# EAGLE design untitled (EAGLE 9.6.2)
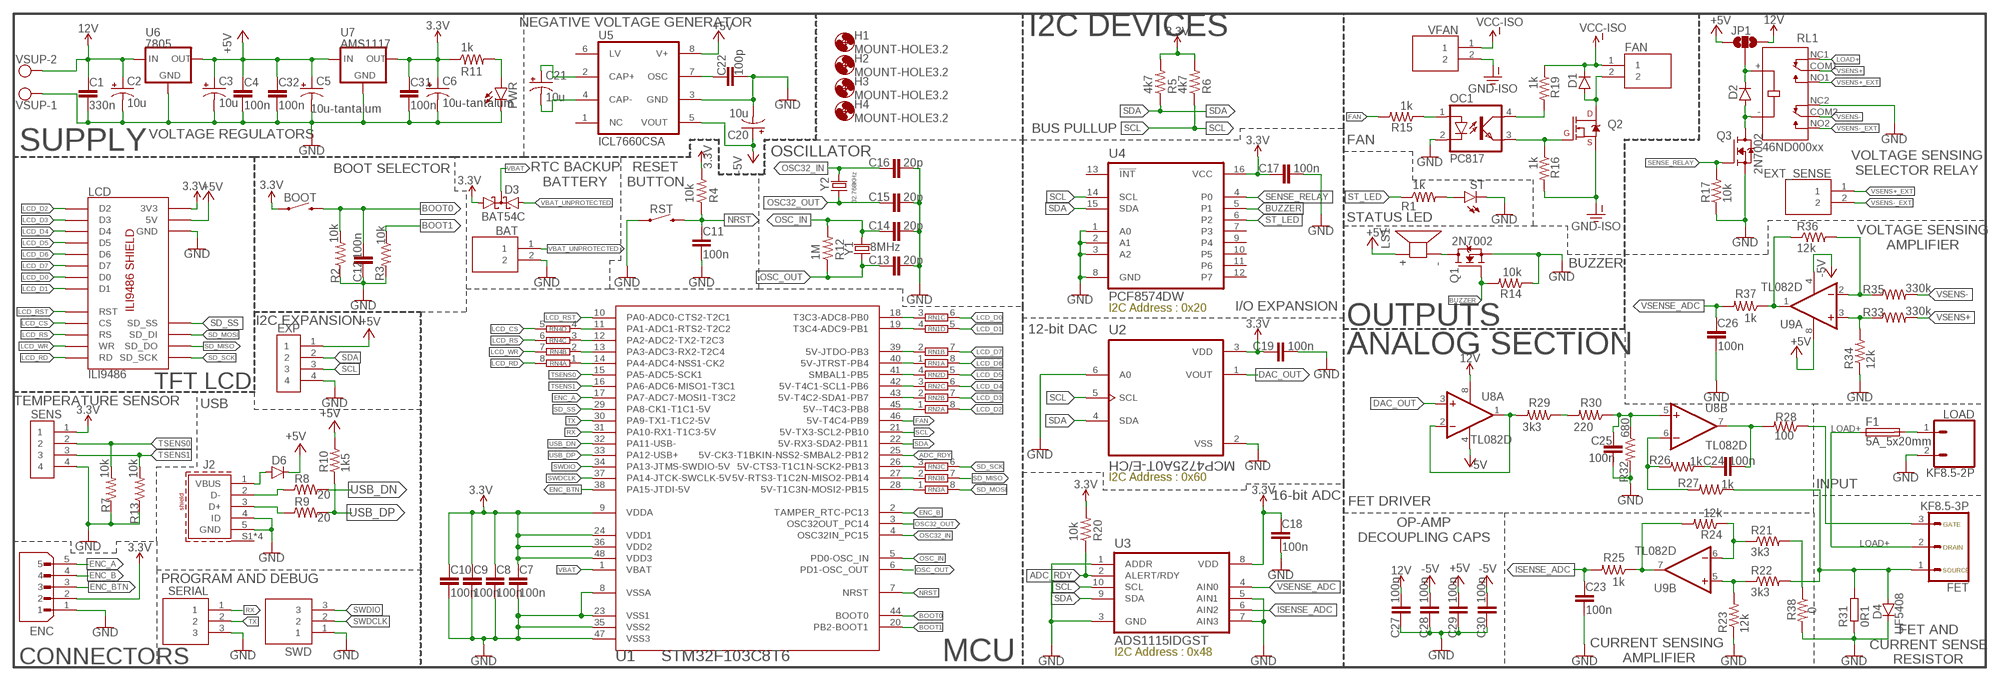
[diagram p0: schematic, sheet 1]

## Parts
BAT  B2B-XH-A(LF)(SN)  [JST_B2B-XH-A(LF)(SN)]
BOOT  MOMENTARY-SWITCH-SPST-SMD-6.0X3.5MM  [TACTILE_SWITCH_SMD_6.0X3.5MM]
C1  330n  C-EUC0805  [C0805]
C2  10u  CPOL-USE2.5-6  [E2,5-6]
C3  10u  CPOL-USE2.5-6  [E2,5-6]
C4  100n  C-EUC0805  [C0805]
C5  10u-tantalum  CPOL-USCT3528  [CT3528]
C6  10u-tantalum  CPOL-USCT3528  [CT3528]
C7  100n  C-EUC0805  [C0805]
C8  100n  C-EUC0805  [C0805]
C9  100n  C-EUC0805  [C0805]
C10  100n  C-EUC0805  [C0805]
C11  100n  C-EUC0805  [C0805]
C12  100n  C-EUC0805  [C0805]
C13  20p  C-EUC0805  [C0805]
C14  20p  C-EUC0805  [C0805]
C15  20p  C-EUC0805  [C0805]
C16  20p  C-EUC0805  [C0805]
C17  100n  C-EUC0805  [C0805]
C18  100n  C-EUC0805  [C0805]
C19  100n  C-EUC0805  [C0805]
C20  10u  CPOL-USE2.5-6  [E2,5-6]
C21  10u  CPOL-USE2.5-6  [E2,5-6]
C22  100p  C-EUC0805  [C0805]
C23  100n  C-EUC0805  [C0805]
C24  100n  C-EUC0805  [C0805]
C25  100n  C-EUC0805  [C0805]
C26  100n  C-EUC0805  [C0805]
C27  100n  C-EUC0805  [C0805]
C28  100n  C-EUC0805  [C0805]
C29  100n  C-EUC0805  [C0805]
C30  100n  C-EUC0805  [C0805]
C31  100n  C-EUC0805  [C0805]
C32  100n  C-EUC0805  [C0805]
D1  DIODE-DO-214AC  [DO-214AC]
D2  DIODE-DO-214AC  [DO-214AC]
D3  BAT54C  [SOT23]
D4  UF5408  DIODE-DO201-15  [DO201-15]
D6  DIODE-DO-214AC  [DO-214AC]
ENC  B5B-XH-A(LF)(SN)  [JST_B5B-XH-A(LF)(SN)]
EXP  JST-XH-4P  B4B-XH-A(LF)(SN)  [JST_B4B-XH-A(LF)(SN)]
EXT_SENSE  B2B-XH-A(LF)(SN)  [JST_B2B-XH-A(LF)(SN)]
F1  5A_5x20mm  FUSEBLANK_5X20MM  [FUSE_HOLDER_5X20MM]
FAN  B2B-XH-A(LF)(SN)  [JST_B2B-XH-A(LF)(SN)]
FET  KF8.5-3P  KF7.62-3P  [KF7.62-3P]
H1  MOUNT-HOLE3.2  [3,2]
H2  MOUNT-HOLE3.2  [3,2]
H3  MOUNT-HOLE3.2  [3,2]
H4  MOUNT-HOLE3.2  [3,2]
J2  629105136821  [629105136821]
JP1  JUMPER-SMT_3_NO_SILK  [SMT-JUMPER_3_NO_SILK]
LCD  ILI9486  [ILI9486-SHIELD]
LOAD  KF8.5-2P  KF7.62-2P  [KF7.62]
LS1  AI-1223-TWT-12V-R  [XDCR_AI-1223-TWT-12V-R]
OC1  PC817  [DIL04]
PWR  LEDCHIP-LED0805  [CHIP-LED0805]
Q1  2N7002  [SOT95P240X111-3N]
Q2  MOSFET-NCH-FDD8780  [TO-252/DPAK]
Q3  2N7002  [SOT95P240X111-3N]
R1  1k  R-US_M0805  [M0805]
R2  10k  R-US_M0805  [M0805]
R3  10k  R-US_M0805  [M0805]
R4  10k  R-US_M0805  [M0805]
R5  4k7  R-US_M0805  [M0805]
R6  4k7  R-US_M0805  [M0805]
R7  10k  R-US_M0805  [M0805]
R8  20  R-US_M0805  [M0805]
R9  20  R-US_M0805  [M0805]
R10  1k5  R-US_M0805  [M0805]
R11  1k  R-US_M0805  [M0805]
R12  1M  R-US_M0805  [M0805]
R13  10k  R-US_M0805  [M0805]
R14  10k  R-US_M0805  [M0805]
R15  1k  R-US_M0805  [M0805]
R16  1k  R-US_M0805  [M0805]
R17  10k  R-US_M0805  [M0805]
R19  1k  R-US_M0805  [M0805]
R20  10k  R-US_M0805  [M0805]
R21  3k3  R-US_R0603  [R0603]
R22  3k3  R-US_R0603  [R0603]
R23  12k  R-US_R0603  [R0603]
R24  12k  R-US_R0603  [R0603]
R25  1k  R-US_R0603  [R0603]
R26  1k  R-US_M0805  [M0805]
R27  1k  R-US_M0805  [M0805]
R28  100  R-US_M0805  [M0805]
R29  3k3  R-US_M0805  [M0805]
R30  220  R-US_M0805  [M0805]
R31  0R1  R-EU_0922/22  [0922/22]
R32  680  R-US_M0805  [M0805]
R33  330k  R-US_R0603  [R0603]
R34  12k  R-US_R0603  [R0603]
R35  330k  R-US_R0603  [R0603]
R36  12k  R-US_R0603  [R0603]
R37  1k  R-US_R0603  [R0603]
R38  0  R-US_M0805  [M0805]
RL1  46ND000xx  G2RL-2_12DC  [RELAY_G2RL-2_12DC]
RN1  4R-N0402ARV341  [4X0402ARV341]
RN2  4R-N0402ARV341  [4X0402ARV341]
RN3  4R-N0402ARV341  [4X0402ARV341]
RN4  4R-N0402ARV341  [4X0402ARV341]
RST  MOMENTARY-SWITCH-SPST-SMD-6.0X3.5MM  [TACTILE_SWITCH_SMD_6.0X3.5MM]
SENS  JST-XH-4P  B4B-XH-A(LF)(SN)  [JST_B4B-XH-A(LF)(SN)]
SERIAL  B3B-XH-A(LF)(SN)  [JST_B3B-XH-A(LF)(SN)]
ST  LEDCHIP-LED0805  [CHIP-LED0805]
SWD  B3B-XH-A(LF)(SN)  [JST_B3B-XH-A(LF)(SN)]
U1  STM32F103C8T6  [TQFP48]
U2  MCP4725A0T-E/CH  [SOT95P270X145-6N]
U3  ADS1115IDGST  [SOP50P490X110-10N]
U4  PCF8574DW  [SOIC127P1030X265-16N]
U5  ICL7660CSA  [SO08]
U6  7805  78XXS  [78XXS]
U7  AMS1117  [SOT89R]
U8  TL082D  [SO08]
U9  TL082D  [SO08]
VFAN  B2B-XH-A(LF)(SN)  [JST_B2B-XH-A(LF)(SN)]
VSUP  MKDSN1,5/2-5,08  [MKDSN1,5/2-5,08]
Y1  8MHz  CRYSTALPTH-HC49US  [HC49US]
Y2  32.768KHz  MC-306  [MC-306]

## Nets
3.3V: BOOT.1 C6.+ C7.1 C8.1 C9.1 C10.1 C17.1 C18.1 C19.1 C31.1 D3.1(A1) ENC.2 LCD.3V3 R4.2 R5.2 R6.2 R11.1 R20.2 SENS.1 U1.9(VDDA) U1.24(VDD1) U1.36(VDD2) U1.48(VDD3) U2.3(VDD) U3.8(VDD) U4.16(VCC) U7.3(OUT) U7.4(OUT)
12V: C1.1 C2.+ C27.2 JP1.3 U6.IN U8.8(P:V+) VSUP.2
+5V: C3.+ C4.1 C5.+ C29.2 C32.1 D6.C EXP.1 JP1.1 LCD.5V LS1.P(+) R10.2 U5.8(V+) U6.OUT U7.1(IN) U9.8(P:V+)
-5V: C20.+ C28.2 C30.2 U5.5(VOUT) U8.4(P:V-) U9.4(P:V-)
ADC_RDY: R20.1 U1.25(5V-CK3-T1BKIN-NSS2-SMBAL2-PB12) U3.2(ALERT/RDY)
BOOT0: BOOT.2 C12.1 R2.2 U1.44(BOOT0)
BOOT1: R3.1 U1.20(PB2-BOOT1)
BUZZER: Q1.1(G) R14.2 U4.5(P1)
DAC_OUT: U2.1(VOUT) U8.3(A:+IN)
ENC_A: ENC.5 U1.17(PA7-ADC7-MOSI1-T3C2)
ENC_B: ENC.4 U1.2(TAMPER_RTC-PC13)
ENC_BTN: ENC.3 U1.38(PA15-JTDI-5V)
FAN: R15.2 U1.46(5V-T4C4-PB9)
GND: BAT.2 C1.2 C2.- C3.- C4.2 C5.- C6.- C7.2 C8.2 C9.2 C10.2 C11.2 C12.2 C13.2 C14.2 C15.2 C16.2 C17.2 C18.2 C19.2 C20.- C22.1 C23.2 C25.1 C26.2 C27.1 C28.1 C29.1 C30.1 C31.2 C32.2 D4.C ENC.1 EXP.4 J2.4(ID) J2.5(GND) LCD.GND LCD.GND1(GND) LCD.GND2(GND) LOAD.2 OC1.2(C) PWR.C Q1.2(S) Q3.2(S) R2.1 R3.2 R7.1 R13.1 R14.1 R17.1 R23.1 R31.1 R32.2 R34.1 R38.2 RL1.NC2 RST.1 SENS.4 SERIAL.3 ST.C SWD.1 U1.8(VSSA) U1.23(VSS1) U1.35(VSS2) U1.47(VSS3) U2.2(VSS) U2.6(A0) U3.1(ADDR) U3.3(GND) U3.5(AIN1) U3.7(AIN3) U4.1(A0) U4.2(A1) U4.3(A2) U4.8(GND) U5.3(GND) U6.GND U7.2(GND) VSUP.1
GND-ISO: Q2.3(S) R16.2 VFAN.2
ISENSE_ADC: C23.1 R25.2 U3.6(AIN2)
LCD_CS: LCD.LCD_CS(CS) RN4.5
LCD_D0: LCD.LCD_D0(D0) RN1.6
LCD_D1: LCD.LCD_D1(D1) RN1.5
LCD_D2: LCD.LCD_D2(D2) RN2.8
LCD_D3: LCD.LCD_D3(D3) RN2.7
LCD_D4: LCD.LCD_D4(D4) RN2.6
LCD_D5: LCD.LCD_D5(D5) RN2.5
LCD_D6: LCD.LCD_D6(D6) RN1.8
LCD_D7: LCD.LCD_D7(D7) RN1.7
LCD_RD: LCD.LCD_RD(RD) RN4.8
LCD_RS: LCD.LCD_RS(RS) RN4.6
LCD_RST: LCD.LCD_RST(RST) U1.10(PA0-ADC0-CTS2-T2C1)
LCD_WR: LCD.LCD_WR(WR) RN4.7
LOAD+: F1.1 FET.2 RL1.NC1
N$1: LS1.N(-) Q1.3(D)
N$2: RN1.3 U1.18(T3C3-ADC8-PB0)
N$3: RN1.4 U1.19(T3C4-ADC9-PB1)
N$4: PWR.A R11.2
N$5: RN1.2 U1.39(5V-JTDO-PB3)
N$6: D6.A J2.1(VBUS)
N$7: RN1.1 U1.40(5V-JTRST-PB4)
N$8: RN2.4 U1.41(SMBAL1-PB5)
N$9: RN2.3 U1.42(5V-T4C1-SCL1-PB6)
N$10: RN2.1 U1.45(5V--T4C3-PB8)
N$11: RN2.2 U1.43(5V-T4C2-SDA1-PB7)
N$12: RN3.3 U1.26(5V-CTS3-T1C1N-SCK2-PB13)
N$13: RN3.2 U1.27(5V-RTS3-T1C2N-MISO2-PB14)
N$14: RN3.1 U1.28(5V-T1C3N-MOSI2-PB15)
N$15: RN4.4 U1.11(PA1-ADC1-RTS2-T2C2)
N$16: J2.3(D+) R9.1
N$17: RN4.3 U1.12(PA2-ADC2-TX2-T2C3)
N$18: J2.2(D-) R8.1
N$19: RN4.1 U1.14(PA4-ADC4-NSS1-CK2)
N$20: RN4.2 U1.13(PA3-ADC3-RX2-T2C4)
N$21: OC1.3(EMIT) Q2.1(G) R16.1
N$22: R1.2 ST.A
N$23: OC1.1(A) R15.1
N$24: D1.A FAN.2 Q2.2(D)
N$25: D2.A Q3.3(D) RL1.-(COIL2)
N$26: OC1.4(COL) R19.2
N$27: D2.C JP1.2 RL1.+(COIL1)
N$29: C21.+ U5.2(CAP+)
N$30: C21.- U5.4(CAP-)
N$31: F1.2 LOAD.1
N$32: C22.2 U5.7(OSC)
N$33: R33.1 R34.2 U9.3(A:+IN)
N$34: D4.A FET.1 R22.2 R27.1 R31.2
N$35: R22.1 R23.2 U9.5(B:+IN)
N$36: R21.1 R24.1 U9.6(B:-IN)
N$37: C24.1 R26.1
N$38: R24.2 R25.1 U9.7(B:OUT)
N$39: C24.2 R28.2 U8.7(B:OUT)
N$40: C25.2 R30.1 R32.1 U8.5(B:+IN)
N$41: R26.2 R27.2 U8.6(B:-IN)
N$42: FET.3 R28.1
N$43: R29.1 R30.2
N$44: R29.2 U8.1(A:OUT) U8.2(A:-IN)
N$45: R35.1 R36.2 U9.2(A:-IN)
N$46: R21.2 R38.1
N$47: R36.1 R37.1 U9.1(A:OUT)
NRST: C11.1 R4.1 RST.2 U1.7(NRST)
OSC32_IN: C16.1 U1.4(OSC32IN_PC15) Y2.4
OSC32_OUT: C15.1 U1.3(OSC32OUT_PC14) Y2.1
OSC_IN: C14.1 R12.2 U1.5(PD0-OSC_IN) Y1.2
OSC_OUT: C13.1 R12.1 U1.6(PD1-OSC_OUT) Y1.1
RX: SERIAL.1 U1.31(PA10-RX1-T1C3-5V)
SCL: EXP.3 R6.1 U1.21(5V-TX3-SCL2-PB10) U2.5(SCL) U3.10(SCL) U4.14(SCL)
SD_MISO: LCD.SD_DO RN3.7
SD_MOSI: LCD.SD_DI RN3.8
SD_SCK: LCD.SD_SCK RN3.6
SD_SS: LCD.SD_SS U1.29(PA8-CK1-T1C1-5V)
SDA: EXP.2 R5.1 U1.22(5V-RX3-SDA2-PB11) U2.4(SDA) U3.9(SDA) U4.15(SDA)
SENSE_RELAY: Q3.1(G) R17.2 U4.4(P0)
ST_LED: R1.1 U4.6(P2)
SWDCLK: SWD.2 U1.37(PA14-JTCK-SWCLK-5V)
SWDIO: SWD.3 U1.34(PA13-JTMS-SWDIO-5V)
TSENS0: R7.2 SENS.2 U1.15(PA5-ADC5-SCK1)
TSENS1: R13.2 SENS.3 U1.16(PA6-ADC6-MISO1-T3C1)
TX: SERIAL.2 U1.30(PA9-TX1-T1C2-5V)
USB_DN: R8.2 U1.32(PA11-USB-)
USB_DP: R9.2 R10.1 U1.33(PA12-USB+)
VBAT: D3.3(CC) U1.1(VBAT)
VBAT_UNPROTECTED: BAT.1 D3.2(A2)
VCC-ISO: D1.C FAN.1 R19.1 VFAN.1
VSENS+: R33.2 RL1.COM1
VSENS+_EXT: EXT_SENSE.1 RL1.NO1
VSENS-: R35.2 RL1.COM2
VSENS-_EXT: EXT_SENSE.2 RL1.NO2
VSENSE_ADC: C26.1 R37.2 U3.4(AIN0)
Unconnected: J2.S1(SHIELD) J2.S2(SHIELD) J2.S3(SHIELD) J2.S4(SHIELD) RN3.4 RN3.5 U4.7(P3) U4.9(P4) U4.10(P5) U4.11(P6) U4.12(P7) U4.13(!INT) U5.1(NC) U5.6(LV)

## Notes on the sheet
- NEGATIVE VOLTAGE GENERATOR
- I2C DEVICES
- BUS PULLUP
- VOLTAGE REGULATORS
- FAN
- SUPPLY
- OSCILLATOR
- VOLTAGE SENSING
  SELECTOR RELAY
- BOOT SELECTOR
- RTC BACKUP
  BATTERY
- RESET
  BUTTON
- STATUS LED
- VOLTAGE SENSING
  AMPLIFIER
- BUZZER
- I/O EXPANSION
- I2C Address : 0x20
- I2C EXPANSION
- 12-bit DAC | OUTPUTS
- ANALOG SECTION
- TFT LCD
- TEMPERATURE SENSOR | USB
- I2C Address : 0x60 | INPUT
- 16-bit ADC
- FET DRIVER
- GATE
- OP-AMP
  DECOUPLING CAPS
- DRAIN
- SOURCE
- PROGRAM AND DEBUG
- FET AND
  CURRENT SENSE
  RESISTOR
- CURRENT SENSING 
  AMPLIFIER
- I2C Address : 0x48
- CONNECTORS | MCU

## Library data of the parts
BAT EXT_SENSE FAN VFAN = hotberry:B2B-XH-A(LF)(SN): Connector Header Through Hole 2 position 0.098" (2.50mm) Check prices <https://pricing.snapeda.com/parts/B2B-XH-A%28LF%29%28SN%29/JST%20Sales/view-part?ref=eda>; AVAILABILITY: In Stock; DESCRIPTION: Connector Header Through Hole 2 position 0.098 (2.50mm); MF: JST Sales; MP: B2B-XH-A(LF)(SN); PACKAGE: None; PRICE: None
BOOT = SparkFun-Switches:MOMENTARY-SWITCH-SPST: Momentary Switch (Pushbutton) - SPST Normally-open (NO) SPST momentary switches (buttons, pushbuttons). Variants PTH-12MM - 12mm square, through-hole Momentary Pushbutton Switch - 12mm Square <https://www.sparkfun.com/products/9190> (COM-09190) PTH-6.0MM, PTH-6.0MM-KIT - 6.0mm square, through-hole Mini Pushbutton Switch <https://www.sparkfun.com/products/97> (COM-00097) KIT package intended for soldering kit's - only one side of pads' copper is exposed. PTH-RIGHT-ANGLE-KIT - Right-angle, through-hole Right Angle Tactile Button <https://www.sparkfun.com/products/10791> - Used on SparkFun BigTime Watch Kit <https://www.sparkfun.com/products/11734> SMD-12MM - 12mm square, surface-mount Tactile Button - SMD (12mm) <https://www.sparkfun.com/products/12993> (COM-12993) Used on SparkFun PicoBoard <https://www.sparkfun.com/products/11888> SMD-4.5MM - 4.5mm Square Trackball Switch Used on SparkFun Blackberry Trackballer Breakout <https://www.sparkfun.com/products/13169> SMD-4.6MMX2.8MM - 4.60mm x 2.80mm, surface mount Used on SparkFun Pro Micro - RP2040 <https://www.sparkfun.com/products/17717> SMD-5.2MM, SMD-5.2-REDUNDANT - 5.2mm square, surface-mount Mini Pushbutton Switch - SMD <https://www.sparkfun.com/products/8720> (COM-08720) Used on Arduino Pro Mini <https://www.sparkfun.com/products/11114> REDUNDANT package connects both switch circuits together SMD-6.0X3.5MM - 6.0 x 3.5mm, surface mount Momentary Reset Switch SMD <https://www.sparkfun.com/products/8229> (COM-08229) SMD-6.2MM-TALL - 6.2mm square, surface mount Tactile Button - SMD (6mm) <https://www.sparkfun.com/products/12992> Used on SparkFun Digital Sandbox <https://www.sparkfun.com/products/12651> SMD-RIGHT-ANGLE - Right-angle, surface mount Used on SparkFun Block for Intel® Edison - Arduino <https://www.sparkfun.com/products/13036>; PROD_ID: SWCH-14278; SF_SKU: COM-08229
C1 C4 C7-C19 C22-C32 = rcl:C-EU: CAPACITOR, European symbol; SPICEPREFIX: C
C2 C3 C5 C6 C20 C21 = rcl:CPOL-US: POLARIZED CAPACITOR, American symbol; SPICEPREFIX: C
D1 D2 D4 D6 = diode:DIODE-: DIODE
D3 = diode:BAT54C: Schottky Diodes Source: Fairchild .. BAT54.pdf
ENC = hotberry:B5B-XH-A(LF)(SN): Connector Header Through Hole 5 position 0.098in (2.50mm); MANUFACTURER: JST; MAXIMUM_PACKAGE_HEIGHT: 7.00mm; PARTREV: N/A; STANDARD: Manufacturer Recommendations
EXP SENS = jst-xh:B4B-XH-A(LF)(SN): XH Series 4 Position 2.5 mm Pitch Through Hole Crimp Top Entry Shrouded Header; MANUFACTURER: JST Sales America Inc; PARTREV: NA; STANDARD: Manufacturer Recommendation
F1 = fuse:FUSE: Fuse; OC_FARNELL: unknown; OC_NEWARK: unknown
FET = SparkFun-Connectors:KF7.62-3P
H1-H4 = holes:MOUNT-HOLE: MOUNTING HOLE with drill center marker
J2 = Wurth_Connectors_WR-USB:629105136821: WR-COM Micro USB 2.0 SMT Type B Horizontal 5 Contacts Kind Properties Durability:10 000 Mating cycles Quality Class:10 000 Mating cycles Connector Type:Micro USB Gender:Receptacle Type:Horizontal General Information Operating Temperature:-40up to +105 °C Compliance:RoHS Electrical Properties IR 1:1A Working Voltage:30V (AC) Withstanding Voltage:100V (AC) Contact Resistance:30 mΩ Material Properties Insulator Material:LCP Insulator Flammability Rating:UL94 V-0 Color:Black Contact Material:Copper Alloy Contact Plating: Gold Contact Type:Stamped Shielding Material:Stainless Steel Shielding Plating:Nickel <https://www.we-online.com/catalog/media/o32999v209%20Family_WR-COM_629105136821.jpg> Details see: https://www.we-online.com/catalog/en/COM_MICRO_SMT_TYPE_B_HORIZONTAL/ Updated by Yingchun, Shan 2020-01-16 2020 (C) Würth Elektronik; APPLICATION: Micro USB 2.0; DATASHEET-URL: https://www.we-online.com/catalog/datasheet/629105136821.pdf; GERDER: Receptacle; INTERFACE-TYPE: Type B; IR1: 1.0A; MOUNT: SMT; PACKAGING: Tape and Reel; PART-NUMBER: 629105136821; PINS: 5; TYPE: Horizontal; WORKING-VOLTAGE: 30V(AC)
JP1 = SparkFun-Jumpers:JUMPER-SMT_3_NO: Normally open jumper This jumper has three pads in close proximity to each other. Apply solder to close the connection(s).
LCD = ILI9486-SHIELD:ILI9486
LOAD = SparkFun-Connectors:KF7.62-2P
LS1 = hotberry:AI-1223-TWT-12V-R; MANUFACTURER: PUI Audio; MAXIMUM_PACKAGE_HEIGHT: 9.7 mm; PARTREV: F; STANDARD: IPC 7351B
OC1 = optocoupler:PC817: SHARP OPTO COUPLER; MPN: PC817X4J000F; OC_FARNELL: 9707727; OC_NEWARK: 97K7059
PWR ST = led:LED: LED OSRAM: - CHIPLED LG R971, LG N971, LY N971, LG Q971, LY Q971, LO R971, LY R971 LH N974, LH R974 LS Q976, LO Q976, LY Q976 LO Q996 - Hyper CHIPLED LW Q18S LB Q993, LB Q99A, LB R99A - SideLED LS A670, LO A670, LY A670, LG A670, LP A670 LB A673, LV A673, LT A673, LW A673 LH A674 LY A675 LS A676, LA A676, LO A676, LY A676, LW A676 LS A679, LY A679, LG A679 - Hyper Micro SIDELED® LS Y876, LA Y876, LO Y876, LY Y876 LT Y87S - SmartLED LW L88C, LW L88S LB L89C, LB L89S, LG L890 LS L89K, LO L89K, LY L89K LS L896, LA L896, LO L896, LY L896 - TOPLED LS T670, LO T670, LY T670, LG T670, LP T670 LSG T670, LSP T670, LSY T670, LOP T670, LYG T670 LG T671, LOG T671, LSG T671 LB T673, LV T673, LT T673, LW T673 LH T674 LS T676, LA T676, LO T676, LY T676, LB T676, LH T676, LSB T676, LW T676 LB T67C, LV T67C, LT T67C, LS T67K, LO T67K, LY T67K, LW E67C LS E67B, LA E67B, LO E67B, LY E67B, LB E67C, LV E67C, LT E67C LW T67C LS T679, LY T679, LG T679 LS T770, LO T770, LY T770, LG T770, LP T770 LB T773, LV T773, LT T773, LW T773 LH T774 LS E675, LA E675, LY E675, LS T675 LS T776, LA T776, LO T776, LY T776, LB T776 LHGB T686 LT T68C, LB T68C - Hyper Mini TOPLED® LB M676 - Mini TOPLED Santana® LG M470 LS M47K, LO M47K, LY M47K Source: http://www.osram.convergy.de LUXEON: - LUMILED® LXK2-PW12-R00, LXK2-PW12-S00, LXK2-PW14-U00, LXK2-PW14-V00 LXK2-PM12-R00, LXK2-PM12-S00, LXK2-PM14-U00 LXK2-PE12-Q00, LXK2-PE12-R00, LXK2-PE12-S00, LXK2-PE14-T00, LXK2-PE14-U00 LXK2-PB12-K00, LXK2-PB12-L00, LXK2-PB12-M00, LXK2-PB14-N00, LXK2-PB14-P00, LXK2-PB14-Q00 LXK2-PR12-L00, LXK2-PR12-M00, LXK2-PR14-Q00, LXK2-PR14-R00 LXK2-PD12-Q00, LXK2-PD12-R00, LXK2-PD12-S00 LXK2-PH12-R00, LXK2-PH12-S00 LXK2-PL12-P00, LXK2-PL12-Q00, LXK2-PL12-R00 Source: www.luxeon.com KINGBRIGHT: KA-3528ASYC Source: www.kingbright.com
Q1 Q3 = hotberry:2N7002: N-Channel 60V 280mA (Ta) 350mW (Ta) Surface Mount SOT-23-3 (TO-236) Check availability <https://pricing.snapeda.com/parts/2N7002/ON%20Semiconductor/view-part?ref=eda>; AVAILABILITY: In Stock; DESCRIPTION: N-Channel 60V 280mA (Ta) 350mW (Ta) Surface Mount SOT-23-3 (TO-236); MF: ON Semiconductor; MP: 2N7002; PACKAGE: SOT-23-3 ON Semiconductor; PRICE: None; PURCHASE-URL: https://pricing.snapeda.com/search/part/2N7002/?ref=eda
Q2 = SparkFun-DiscreteSemi:MOSFET-NCH: N-channel MOSFETs Voltage controlled devices that allow control of high current outputs. SparkFun Products: SparkFun OpenScale <https://www.sparkfun.com/products/13261> SparkFun Digital Sandbox <https://www.sparkfun.com/products/12651> SparkFun Monster Moto Shield <https://www.sparkfun.com/products/10182> SparkFun MOSFET Power Controller <https://www.sparkfun.com/products/11214>; PROD_ID: TRANS-09984; VALUE: 35A/25V/8.5mΩ
R1-R17 R19-R30 R32-R38 = rcl:R-US_: RESISTOR, American symbol; SPICEPREFIX: R
R31 = rcl:R-EU_: RESISTOR, European symbol; SPICEPREFIX: R
RL1 = G2RL-2_12DC:G2RL-2_12DC: Check availability <https://pricing.snapeda.com/parts/G2RL-2%2012DC/Omron/view-part?ref=eda>; AVAILABILITY: Not in stock; DESCRIPTION: Power Relay 12VDC 8A DPDT (( 29mm 12.7mm 15.7mm)) Through Hole; MF: Omron; MP: G2RL-2 12DC; PACKAGE: None; PRICE: None
RN1 = resistor-dil:4R-N: Array Chip Resistor Source: RS Component / Phycomp; OC_FARNELL: unknown; OC_NEWARK: unknown; SPICEPREFIX: R
RN2-RN4 = resistor-dil:4R-N: Array Chip Resistor Source: RS Component / Phycomp; OC_FARNELL: unknown; OC_NEWARK: unknown
RST = SparkFun-Switches:MOMENTARY-SWITCH-SPST: Momentary Switch (Pushbutton) - SPST Normally-open (NO) SPST momentary switches (buttons, pushbuttons). Variants PTH-12MM - 12mm square, through-hole Momentary Pushbutton Switch - 12mm Square <https://www.sparkfun.com/products/9190> (COM-09190) PTH-6.0MM, PTH-6.0MM-KIT - 6.0mm square, through-hole Mini Pushbutton Switch <https://www.sparkfun.com/products/97> (COM-00097) KIT package intended for soldering kit's - only one side of pads' copper is exposed. PTH-RIGHT-ANGLE-KIT - Right-angle, through-hole Right Angle Tactile Button <https://www.sparkfun.com/products/10791> - Used on SparkFun BigTime Watch Kit <https://www.sparkfun.com/products/11734> SMD-12MM - 12mm square, surface-mount Tactile Button - SMD (12mm) <https://www.sparkfun.com/products/12993> (COM-12993) Used on SparkFun PicoBoard <https://www.sparkfun.com/products/11888> SMD-4.5MM - 4.5mm Square Trackball Switch Used on SparkFun Blackberry Trackballer Breakout <https://www.sparkfun.com/products/13169> SMD-4.6MMX2.8MM - 4.60mm x 2.80mm, surface mount Used on SparkFun Pro Micro - RP2040 <https://www.sparkfun.com/products/17717> SMD-5.2MM, SMD-5.2-REDUNDANT - 5.2mm square, surface-mount Mini Pushbutton Switch - SMD <https://www.sparkfun.com/products/8720> (COM-08720) Used on Arduino Pro Mini <https://www.sparkfun.com/products/11114> REDUNDANT package connects both switch circuits together SMD-6.0X3.5MM - 6.0 x 3.5mm, surface mount Momentary Reset Switch SMD <https://www.sparkfun.com/products/8229> (COM-08229) SMD-6.2MM-TALL - 6.2mm square, surface mount Tactile Button - SMD (6mm) <https://www.sparkfun.com/products/12992> Used on SparkFun Digital Sandbox <https://www.sparkfun.com/products/12651> SMD-RIGHT-ANGLE - Right-angle, surface mount Used on SparkFun Block for Intel® Edison - Arduino <https://www.sparkfun.com/products/13036>; PROD_ID: SWCH-14278; SF_SKU: COM-08229; SPICEPREFIX: R
SERIAL SWD = hotberry:B3B-XH-A(LF)(SN): Connector Header Through Hole 3 position 0.098" (2.50mm) Check prices <https://pricing.snapeda.com/parts/B3B-XH-A%28LF%29%28SN%29/JST%20Sales/view-part?ref=eda>; AVAILABILITY: In Stock; DESCRIPTION: Connector Header Through Hole 3 position 0.098 (2.50mm); MF: JST Sales; MP: B3B-XH-A(LF)(SN); PACKAGE: None; PRICE: None
U1 = stm32:STM32F103C8T6
U2 = MCP4725A0T-E_CH:MCP4725A0T-E/CH: MCP4725 Series 1 Ch I2C EEPROM Memory 5.5 V 12-Bit D/A Converter SMT - SOT-23-6 Check availability <https://pricing.snapeda.com/parts/MCP4725A0T-E/CH/Microchip/view-part?ref=eda>; AVAILABILITY: In Stock; DESCRIPTION: 12 Bit Digital to Analog Converter 1 SOT-23-6; MF: Microchip; MP: MCP4725A0T-E/CH; PACKAGE: SOT-23-6 Microchip; PRICE: None; PURCHASE-URL: https://pricing.snapeda.com/search/part/MCP4725A0T-E/CH/?ref=eda
U3 = ADS1115IDGST:ADS1115IDGST: Check availability <https://pricing.snapeda.com/parts/ADS1115IDGST/Texas%20Instruments/view-part?ref=eda>; AVAILABILITY: In Stock; DESCRIPTION: 16-Bit 860SPS 4-Ch Delta-Sigma ADC With PGA, Oscillator, Vref, Comparator, and I2C 10-VSSOP -40 to 125; MF: Texas Instruments; MP: ADS1115IDGST; PACKAGE: VSSOP-10 Texas Instruments; PRICE: None; PURCHASE-URL: https://pricing.snapeda.com/search/part/ADS1115IDGST/?ref=eda
U4 = PCF8574DW:PCF8574DW: Check availability <https://pricing.snapeda.com/parts/PCF8574DW/Texas%20Instruments/view-part?ref=eda>; AVAILABILITY: In Stock; DESCRIPTION: Remote 8-Bit I/O Expander for I2C-Bus 16-SOIC -40 to 85; MF: Texas Instruments; MP: PCF8574DW; PACKAGE: SOIC-16 Texas Instruments; PRICE: None; PURCHASE-URL: https://pricing.snapeda.com/search/part/PCF8574DW/?ref=eda
U5 = ICL7660CSA:ICL7660CSA: VOLTAGE CONVERTER Check availability <https://pricing.snapeda.com/parts/ICL7660CSA/Maxim%20Integrated/view-part?ref=eda>; AVAILABILITY: In Stock; DESCRIPTION: Switching Voltage Regulators Switched-Capacitor Voltage Converter; MF: Maxim Integrated; MP: ICL7660CSA; PACKAGE: SOIC-8 Maxim; PRICE: None; PURCHASE-URL: https://pricing.snapeda.com/search/part/ICL7660CSA/?ref=eda
U6 = v-reg:78XXS: VOLTAGE REGULATOR
U7 = v-reg:AMS1117
U8 U9 = linear:TL082: OP AMP Data sheet <http://www.ti.com/lit/ds/symlink/tl084a . pdf>; DATA_SHEET: <a href="http://www.ti.com/lit/ds/symlink/tl084a.pdf"> Data sheet </a>
VSUP = con-phoenix-508:MKDSN1,5/2-5,08: MKDSN 1,5/ 2-5,08 Printklemme Nennstrom: 13,5 A Nennspannung: 250 V Rastermaß: 5,08 mm Polzahl: 2 Anschlussart: Schraubanschluss Montage: Löten Anschlussrichtung Leiter/Platine: 0 ° Artikelnummer: 1729128 Source: http://eshop.phoenixcontact.com .. 1729128.pdf
Y1 = SparkFun-Clocks:CRYSTAL: Crystals (Generic) These are passive quartz crystals, which can be used as a clock source for a microcontroller. Crystal's are two-terminal devices. They require external "load" capacitors to generate an oscillating signal.
Y2 = crystal:MC-306: kHz RANGE CRYSTAL UNIT SMD Source: MC-306_405_406_E07X.PDF Homepage <http://www.epsontoyocom.co.jp>; MPN: MC-306 60.0KHZ 100PPM ,12.5PF; OC_FARNELL: 1278040; OC_NEWARK: 31M5576

## Board
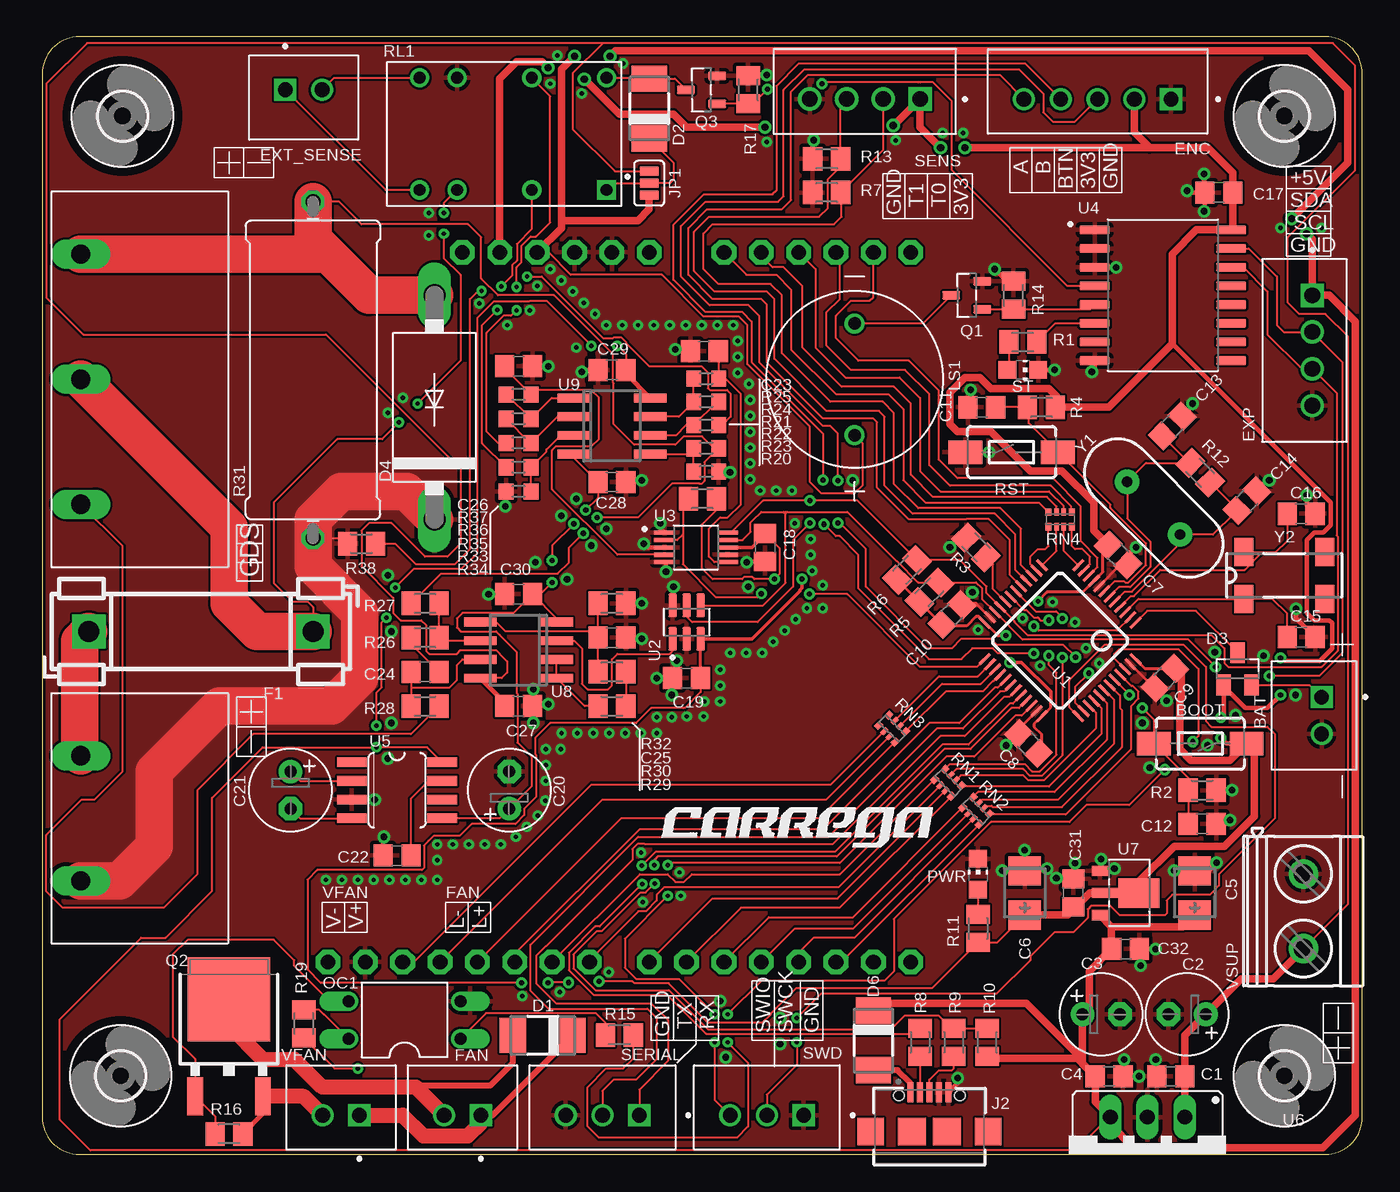
[diagram p1: board, top side]
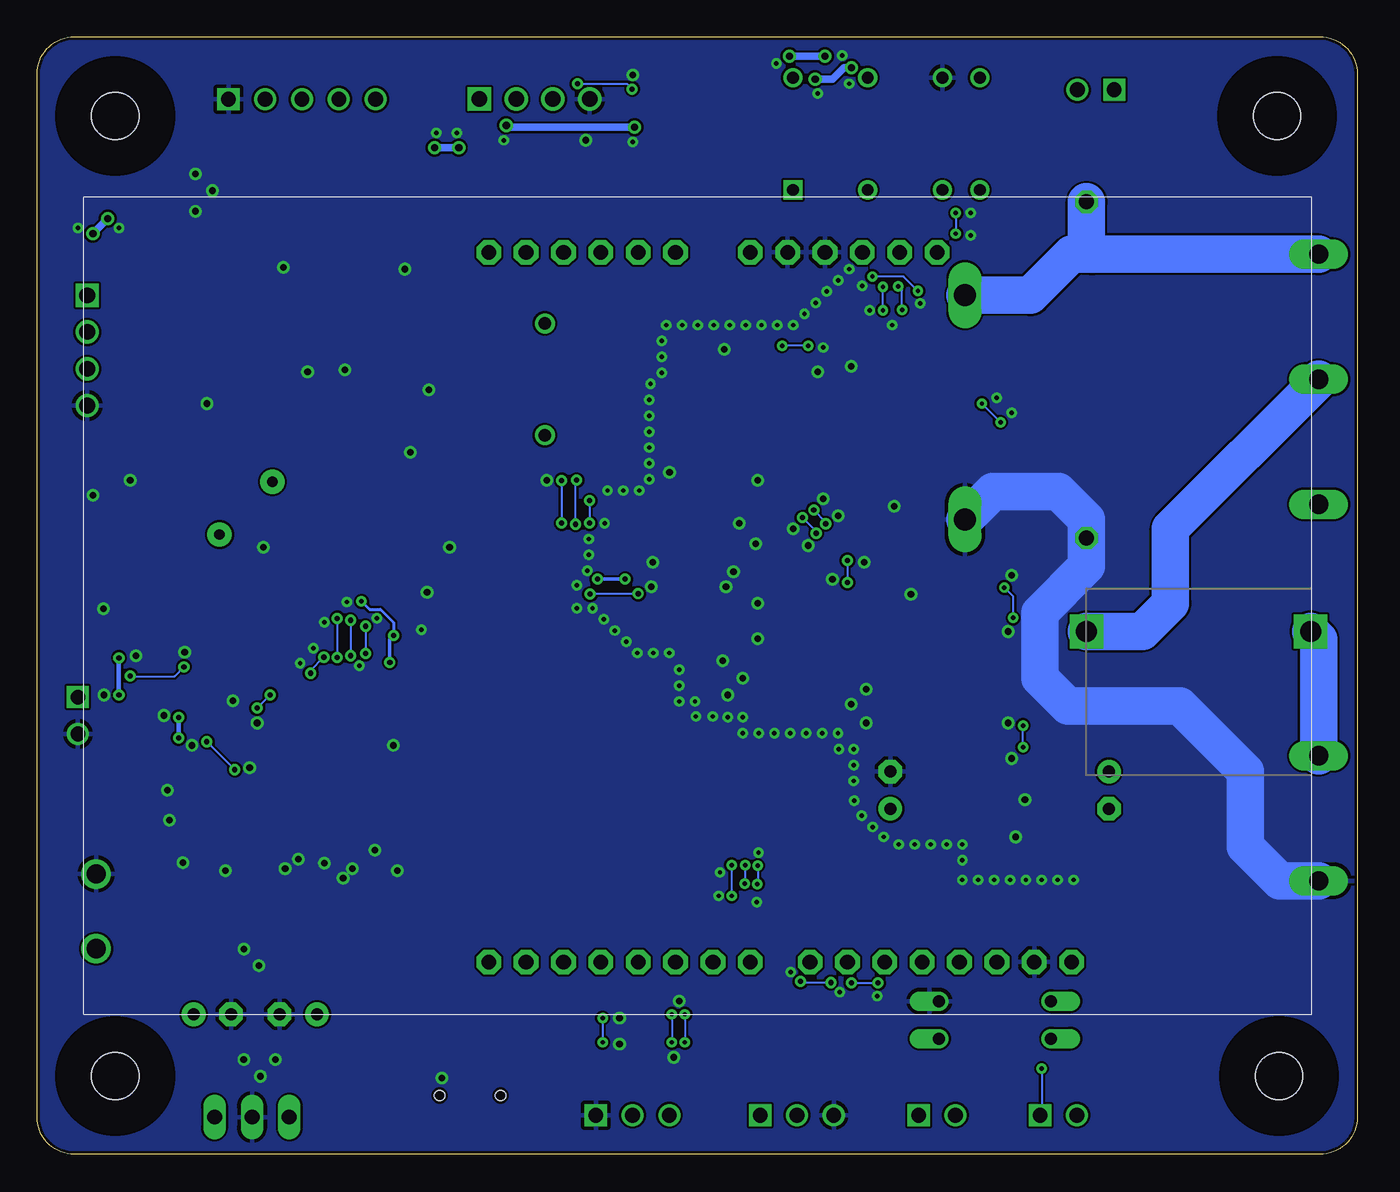
[diagram p2: board, bottom side, seen from below]

Size 89.77 x 76 mm. Coordinates in mm from the lower left corner, seen from the top.
Outline: 87.23,76 2.54,76 arc90 0,73.46 0,2.54 arc90 2.54,0 87.23,0 arc90 89.77,2.54 89.77,73.46 arc90 87.23,76
Copper layers (1*16): Top 0.035mm / dielectric 1.5mm / Bottom 0.035mm
Design rules "nextpcb *": minimum track width 6mil, minimum drill 0.3mm, track to track 6mil, track to pad 6mil, pad to pad 6mil, via to via 6mil, smd to smd 6mil, copper to edge 8mil, drill to drill 6mil, minimum pad ring 10mil, minimum via ring 8mil, stop-mask expansion 4mil, vias tented up to drill 25mil, thermal gap 10mil

### Footprints (pad centres in the part's own frame; a part is rotated, then mirrored left to right if it is on the bottom)
JST_B2B-XH-A(LF)(SN) = drill 1 square: 1 1.25,0 | drill 1: 2 -1.25,0
TACTILE_SWITCH_SMD_6.0X3.5MM = smd 2.3 x 1.6: 1 -3.15,0; 2 3.15,0
C0805 = smd 1.3 x 1.5: 1 -0.95,0; 2 0.95,0
E2,5-6 = drill 0.813 pad 1.6: + -1.27,0 | drill 0.813 pad 1.6 octagon: - 1.27,0
CT3528 = smd 2 x 2.2: + -1.5,0; - 1.5,0
DO-214AC = smd 1.8 x 2.4: A 2.025,0; C -2.025,0
SOT23 = smd 1 x 1.4: 1 -0.95,-1.1; 2 0.95,-1.1; 3 0,1.1
DO201-15 = drill 1.499 long: A 7.62,0; C -7.62,0
JST_B5B-XH-A(LF)(SN) = drill 1 square: 1 -5,0 | drill 1: 2 -2.5,0; 3 0,0; 4 2.5,0; 5 5,0
JST_B4B-XH-A(LF)(SN) = drill 1.06 square: 1 0,0 | drill 1.06: 2 2.5,0; 3 5,0; 4 7.5,0
FUSE_HOLDER_5X20MM = drill 1.422 pad 2.286 square: 1 0,0; 2 15.24,0
KF7.62-3P = drill 1.3 pad 2 long: 1 -8.5,-5.75; 2 0,-5.75; 3 8.5,-5.75
3,2 = hole 3.2: 0,0
629105136821 = smd 0.4 x 1.35: 1 -1.3,2.325; 2 -0.65,2.325; 3 0,2.325; 4 0.65,2.325; 5 1.3,2.325 | smd 1.8 x 1.9: S1 -4,-0.35; S4 4,-0.35 | smd 1.9 x 1.9: S2 -1.2,-0.35; S3 1.2,-0.35 | hole 0.7: -2.075,2.1; 2.075,2.1
SMT-JUMPER_3_NO_SILK = smd 0.635 x 1.27: 1 -0.813,0; 2 0,0; 3 0.813,0
ILI9486-SHIELD = drill 1 pad 1.676 octagon: 3V3 2.54,-26.67; 5V 5.08,-26.67; GND -6.604,21.59; GND1 10.16,-26.67; GND2 7.62,-26.67; LCD_CS 25.4,-26.67; LCD_D0 8.636,21.59; LCD_D1 6.096,21.59; LCD_D2 25.4,21.59; LCD_D3 22.86,21.59; LCD_D4 20.32,21.59; LCD_D5 17.78,21.59; LCD_D6 15.24,21.59; LCD_D7 12.7,21.59; LCD_RD 17.78,-26.67; LCD_RS 22.86,-26.67; LCD_RST 27.94,-26.67; LCD_WR 20.32,-26.67; NC0 30.48,21.59; NC1 27.94,21.59; NC2 -9.144,21.59; NC3 30.48,-26.67; NC4 12.7,-26.67; NC5 0,-26.67; SD_DI 1.016,21.59; SD_DO -1.524,21.59; SD_SCK -4.064,21.59; SD_SS 3.556,21.59
KF7.62 = drill 1.3 pad 2 long: 1 -4.25,-5.75; 2 4.25,-5.75
XDCR_AI-1223-TWT-12V-R = drill 0.85: N 0,-3.8; P 0,3.8
DIL04 = drill 0.813 offset: 1 -1.27,-3.81; 2 1.27,-3.81; 3 1.27,3.81; 4 -1.27,3.81
CHIP-LED0805 = smd 1.2 x 1.2: A 0,-1.05; C 0,1.05
SOT95P240X111-3N = smd 1.23 x 0.6: 1 -1.06,0.95; 2 -1.06,-0.95; 3 1.06,0
TO-252/DPAK = smd 1.06 x 2.6: 1 -2.3,-4.31; 3 2.3,-4.31 | smd 5.632 x 5.7: 2 0,2.288
M0805 = smd 1.3 x 1.6: 1 -0.95,0; 2 0.95,0
R0603 = smd 1 x 1.1: 1 -0.85,0; 2 0.85,0
0922/22 = drill 1.016 octagon: 1 -11.43,0; 2 11.43,0
RELAY_G2RL-2_12DC = drill 0.8 square: + 1,8.71 | drill 0.8: - 1,1.09; COM1 6.08,8.71; COM2 6.08,1.09; NC1 11.16,8.71; NC2 11.16,1.09; NO1 13.7,8.71; NO2 13.7,1.09
4X0402ARV341 = smd 0.4 x 0.5: 1 -0.8,-0.5; 4 0.8,-0.5; 5 0.8,0.5; 8 -0.8,0.5 | smd 0.3 x 0.5: 2 -0.25,-0.5; 3 0.25,-0.5; 6 0.25,0.5; 7 -0.25,0.5
JST_B3B-XH-A(LF)(SN) = drill 1 square: 1 2.5,0 | drill 1: 2 0,0; 3 -2.5,0
TQFP48 = smd 0.2 x 1: 1 -2.75,-4.5; 2 -2.25,-4.5; 3 -1.75,-4.5; 4 -1.25,-4.5; 5 -0.75,-4.5; 6 -0.25,-4.5; 7 0.25,-4.5; 8 0.75,-4.5; 9 1.25,-4.5; 10 1.75,-4.5; 11 2.25,-4.5; 12 2.75,-4.5; 25 2.75,4.5; 26 2.25,4.5; 27 1.75,4.5; 28 1.25,4.5; 29 0.75,4.5; 30 0.25,4.5; 31 -0.25,4.5; 32 -0.75,4.5; 33 -1.25,4.5; 34 -1.75,4.5; 35 -2.25,4.5; 36 -2.75,4.5 | smd 1 x 0.2: 13 4.5,-2.75; 14 4.5,-2.25; 15 4.5,-1.75; 16 4.5,-1.25; 17 4.5,-0.75; 18 4.5,-0.25; 19 4.5,0.25; 20 4.5,0.75; 21 4.5,1.25; 22 4.5,1.75; 23 4.5,2.25; 24 4.5,2.75; 37 -4.5,2.75; 38 -4.5,2.25; 39 -4.5,1.75; 40 -4.5,1.25; 41 -4.5,0.75; 42 -4.5,0.25; 43 -4.5,-0.25; 44 -4.5,-0.75; 45 -4.5,-1.25; 46 -4.5,-1.75; 47 -4.5,-2.25; 48 -4.5,-2.75
SOT95P270X145-6N = smd 1.61 x 0.59: 1 -1.145,0.95; 2 -1.145,0; 3 -1.145,-0.95; 4 1.145,-0.95; 5 1.145,0; 6 1.145,0.95
SOP50P490X110-10N = smd 1.47 x 0.28: 1 -2.15,1; 2 -2.15,0.5; 3 -2.15,0; 4 -2.15,-0.5; 5 -2.15,-1; 6 2.15,-1; 7 2.15,-0.5; 8 2.15,0; 9 2.15,0.5; 10 2.15,1
SOIC127P1030X265-16N = smd 2.06 x 0.6: 1 -4.64,4.445; 2 -4.64,3.175; 3 -4.64,1.905; 4 -4.64,0.635; 5 -4.64,-0.635; 6 -4.64,-1.905; 7 -4.64,-3.175; 8 -4.64,-4.445; 9 4.64,-4.445; 10 4.64,-3.175; 11 4.64,-1.905; 12 4.64,-0.635; 13 4.64,0.635; 14 4.64,1.905; 15 4.64,3.175; 16 4.64,4.445
SO08 = smd 0.66 x 2.032: 1 -1.905,-3.073; 2 -0.635,-3.073; 3 0.635,-3.073; 4 1.905,-3.073; 5 1.905,3.073; 6 0.635,3.073; 7 -0.635,3.073; 8 -1.905,3.073
78XXS = drill 1.016 long: GND 0,-2.54; IN -2.54,-2.54; OUT 2.54,-2.54
SOT89R = smd 0.7 x 1.1: 1 1.5,-1.75; 2 -1.5,-1.75 | smd 0.7 x 1.8: 3 0,-1.4 | smd 2 x 2.8: 4 0,0.9
SO08' = smd 0.6 x 2.2: 1 -1.905,-2.6; 2 -0.635,-2.6; 3 0.635,-2.6; 4 1.905,-2.6; 5 1.905,2.6; 6 0.635,2.6; 7 -0.635,2.6; 8 -1.905,2.6
MKDSN1,5/2-5,08 = drill 1.3 pad 2: 1 -2.561,0.025; 2 2.519,0.025
HC49US = drill 0.7 pad 1.651: 1 -2.54,0; 2 2.54,0
MC-306 = smd 1.3 x 1.9: 1 -2.75,-1.6; 2 2.75,-1.6; 3 2.75,1.6; 4 -2.75,1.6

### Placement (x,y rotation side)
BAT  87,29.84 90 top
BOOT  78.74,27.94 180 top
C1  76.73,5.31 180 top
C2  77.85,9.53 180 top
C3  72.01,9.53 0 top
C4  72.54,5.31 0 top
C5  78.36,17.78 90 top
C6  66.8,17.78 90 top
C7  73.15,40.77 315 top
C8  67.06,27.94 135 top
C9  76.33,32.38 225 top
C10  61.85,36.7 45 top
C11  63.88,50.8 180 top
C12  78.87,22.48 0 top
C13  76.84,49.53 45 top
C14  81.92,44.45 45 top
C15  85.6,35.18 0 top
C16  85.6,43.56 0 top
C17  80.01,65.41 180 top
C18  49.15,41.27 270 top
C19  43.81,32.38 180 top
C20  31.75,24.77 90 top
C21  16.89,24.77 270 top
C22  24.13,20.32 0 top
C23  45.02,54.61 180 top
C24  26.04,32.81 180 top
C25  38.73,35.14 180 top
C26  32.38,53.59 0 top
C27  32.38,30.48 180 top
C28  38.73,45.72 180 top
C29  38.73,53.34 0 top
C30  32.38,38.1 0 top
C31  70.1,17.78 90 top
C32  73.66,13.97 0 top
D1  34.04,8.1 180 top
D2  41.27,71.12 90 top
D3  81.28,33.02 0 top
D4  26.67,50.8 90 top
D6  56.52,7.75 270 top
ENC  71.76,71.75 180 top
EXP  86.36,58.42 270 top
EXT_SENSE  17.78,72.39 180 top
F1  18.41,35.56 180 top
FAN  28.57,2.67 0 top
FET  8.38,52.7 270 top
H1  5.33,5.33 0 top
H2  5.46,70.61 0 top
H3  84.46,5.33 0 top
H4  84.46,70.61 180 top
J2  60.32,1.91 0 top
JP1  41.27,66.04 90 top
LCD  28.57,34.67 180 bottom
LOAD  8.38,22.86 270 top
LS1  55.24,52.7 180 top
OC1  24.64,9.14 90 top
PWR  63.63,19.05 0 top
Q1  62.87,58.42 180 top
Q2  12.7,8.26 0 top
Q3  44.83,72.39 180 top
R1  66.68,55.24 180 top
R2  78.87,24.77 180 top
R3  63.5,41.27 135 top
R4  67.95,50.8 0 top
R5  60.32,38.23 225 top
R6  58.8,39.75 225 top
R7  53.34,65.41 0 top
R8  59.69,7.62 90 top
R9  61.98,7.62 90 top
R10  64.26,7.62 270 top
R11  63.63,15.37 90 top
R12  78.74,46.35 315 top
R13  53.34,67.69 0 top
R14  66.04,58.42 270 top
R15  39.24,8.13 0 top
R16  12.7,1.4 0 top
R17  48.01,72.39 270 top
R19  17.78,8.89 90 top
R20  44.89,44.58 0 top
R21  45.15,49.59 0 top
R22  45.15,48.01 0 top
R23  45.15,46.44 180 top
R24  45.15,51.17 180 top
R25  45.15,52.75 0 top
R26  26.04,35.14 0 top
R27  26.04,37.47 0 top
R28  26.04,30.48 180 top
R29  38.73,30.48 180 top
R30  38.73,32.81 0 top
R31  18.41,53.34 90 top
R32  38.73,37.47 0 top
R33  32.38,46.73 180 top
R34  32.38,45.08 0 top
R35  32.38,48.37 180 top
R36  32.38,50.02 180 top
R37  32.38,51.67 0 top
R38  21.72,41.53 180 top
RL1  39.37,74.3 180 top
RN1  61.59,25.27 135 top
RN2  63.5,23.37 135 top
RN3  57.78,28.96 135 top
RN4  69.22,43.18 0 top
RST  65.91,47.75 0 top
SENS  59.69,71.75 180 top
SERIAL  38.1,2.67 0 top
ST  66.68,53.34 270 top
SWD  49.28,2.67 0 top
U1  69.22,34.92 135 top
U2  43.81,36.2 90 top
U3  44.45,41.27 0 top
U4  76.2,58.42 0 top
U5  24.13,24.77 270 top
U6  75.16,0 180 top
U7  73.66,17.78 270 top
U8  TL082D  [SO08']  32.38,34.29 90 top
U9  TL082D  [SO08']  38.73,49.53 270 top
VFAN  20.32,2.67 0 top
VSUP  85.73,16.51 270 top
Y1  75.57,43.94 315 top
Y2  84.46,39.37 0 top

### Tracks (layer width: path | path; a pad name or v marks a point on that pad's centre or on a via)
3.3V  (via drill 0.3, 0.35, 0.5)
  Top 0.152: R20.2 45.84,43.81 44.83,42.8 44.83,39.88 45.59,39.12 47.59,39.12 47.73,39.27 48.28,39.27 48.43,39.12 v49.78,39.12 50.16,39.5 50.16,41.21 49.18,42.19 C18.1 | 59.69,71.17 59.69,71.5 SENS.1 | C6.+ 64.94,14.42 R11.1 60.51,11.3 51.27,11.3 49.51,9.54 49.51,9.5 48.95,8.94 45.29,8.94 42.6,11.63 40.26,11.63 40.13,11.76 v37.86,11.76 | C19.1 44.77,31.43 43.7,30.36 43.58,30.36 43.57,30.35 41.4,30.35 40.39,29.34 34.54,29.34 33.53,28.32 33.53,27.23 33.58,27.18 33.58,24.31 32.78,23.51 32.78,23.07 32.18,22.47 29.2,22.47 28.39,21.66 26.61,21.66 26.27,21.32 25.96,21.01 25.96,19.48 25.82,19.34 18.71,19.34 18.03,18.67 18.03,12.57 18.95,11.66 v32.59,11.66 | v35.8,11.68 34.42,11.68 v34.4,11.67
  Top 0.203: U1.48 74.97,33.06 C9.1 | C8.1 67.95,27.48 67.95,28.58 67.44,29.08 67.44,29.26 U1.36 68.58,30.4 68.58,30.86 | v65.53,35.28 64.97,35.28 U1.24 63.67,36.58 63.5,36.58 62.87,35.94 61.27,35.94 C10.1 R5.2 R6.2 | C19.1 U2.3 | C7.1 72.14,41.09 72.14,39.61 U1.9 70.75,38.23 68.33,38.23 v67.71,37.61
  Top 0.254: 69.02,50.67 68.99,50.7 R4.2 | 68.58,30.86 68.58,31.47 66.59,33.46 v65.79,33.46 | U3.8 48.26,41.27 49.18,42.19 | U2.3 48.26,35.05 51.51,38.3 51.51,38.37 51.66,38.52 v51.66,39.12
  Top 0.305: 76.84,55.12 87.63,44.32 87.63,42.81 87.11,42.29 86.5,42.29 85.98,41.77 85.98,36.83 86.49,36.32 87.5,36.32 87.7,36.12 87.7,34.39 86.85,33.54 84.41,33.54 v84.2,33.75 | v84.2,31.24 83.31,30.35 81.79,30.35 80.33,31.81 D3.1 80.33,29.91 v80.14,29.72 | v80.14,28.32 80.52,27.94 BOOT.1
  Top 0.508: 70.3,16.83 C31.1 | 70.3,16.83 71.25,17.78 U7.3 U7.4 74.56,18.55 76.96,20.95 80.39,20.95 82.42,22.99 82.42,27.41 BOOT.1 80.75,26.8 78.11,26.8 77.34,27.56 77.34,30.86 77.47,30.99 77.47,32.59 C9.1 | C6.+ 69.75,16.28 70.3,16.83 | C7.1 71.5,42.42 71.5,44.32 69.34,46.48 67.18,46.48 64.52,49.15 62.23,49.15 61.72,49.66 61.72,51.82 62.74,52.83 63.75,52.83 64.52,52.07 68.45,52.07 68.99,51.53 68.99,50.7 | R4.2 72.52,50.8 76.84,55.12 76.84,61.21 78.49,62.87 U4.16 80.96,62.98 C17.1 80.96,66.74 79.25,68.45 75.31,68.45 | ENC.2 74.26,69.51 75.31,68.45 | v61.09,68.45 59.69,69.85 59.69,71.5 | 75.31,68.45 v62.74,68.45 | SENS.1 57.91,69.98 v57.87,69.98 | v49.15,69.85 43.81,69.85 42.93,70.74 39.24,70.74 v36.87,73.11 | v34.4,73.9 34,74.3 32.26,74.3 31.11,73.15 LCD.3V3
  Bottom 0.152: v37.86,11.76 37.78,11.68 v35.8,11.68 | v34.4,11.67 v34.39,11.66 v32.59,11.66
  Bottom 0.203: v67.71,37.61 67.16,37.06 66.42,37.06 65.53,36.16 v65.53,35.28
  Bottom 0.254: v65.79,33.46 65.79,35.02 v65.53,35.28 | v51.66,39.12 v49.78,39.12
  Bottom 0.305: v84.2,33.75 v84.2,31.24 | v80.14,29.72 v80.14,28.32
  Bottom 0.508: v62.74,68.45 v61.09,68.45 | v57.87,69.98 57.74,69.85 v49.15,69.85 | v36.87,73.11 35.69,73.11 34.91,73.9 v34.4,73.9
12V
  Top 0.152: VSUP.2 88.8,17.04 88.8,55.6 87.25,57.15 85.47,57.15 84.71,57.91 84.71,62.36 89.28,66.93 89.28,74.04 87.76,75.57 38.12,75.57 | 38.12,75.57 36.07,73.51 36.07,69.72 38.94,66.85 JP1.3 | 38.12,75.57 3.05,75.57 0.28,72.8 0.28,58.27 2.79,55.75 19.3,55.75 28.45,46.61 28.45,41.53 27.56,40.64 26.04,40.64 23.75,42.93 22.22,42.93 21.72,42.42 21.72,40.01 23.88,37.85 23.88,36.83 24.38,36.32 25.78,36.32 26.11,36 26.11,34.24 26.31,34.04 28.19,34.04 28.45,34.29 30.87,34.29 31.11,34.05 31.11,34.04 31.62,33.53 31.62,32.77 31.24,32.38 U8.8
  Top 0.305: U8.8 31.43,30.73 C27.2
  Top 0.508: VSUP.2 83.7,11.94 81.53,11.94 C2.+ 77.68,8.09 C1.1 77.68,2.56 U6.IN
+5V  (via drill 0.3, 0.5)
  Top 0.152: U6.OUT 72.54,2.54 70.28,0.28 3.28,0.28 1.19,2.36 1.19,9.2 6.73,14.73 8.38,14.73 11.56,17.91 11.56,24.26 14.99,27.69 v22.73,27.69 26.19,27.69 U5.8 | LS1.P 55.8,48.35 55.8,45.52 55.24,44.96 52.96,44.96 52.2,45.72 52.2,49.48 47.94,53.74 47.94,56.4 47.37,56.97 44.98,56.97 42.13,59.82 35.94,59.82 34.42,61.34 LCD.5V | v22.73,29.16 22.73,31.41 23.09,31.76 23.09,36.17 v23.4,36.48 | v24,38.55 25.28,39.83 28.52,39.83 29.59,40.89 29.59,56.89 30.72,58.02 33.12,58.02 33.15,58.04 34.29,58.04 v37.34,54.99 | v39.12,54.99 39.69,54.42 C29.2
  Top 0.305: C29.2 39.69,53.09 U9.8
  Top 0.508: C4.1 71.59,3.57 U6.OUT 72.62,2.03 74.19,0.46 87.07,0.46 89.28,2.67 89.28,56.64 87.5,58.42 EXP.1 86.36,62.23 v85.98,62.61 | R10.2 64.41,6.52 70.38,6.52 C4.1 | 56.77,10.03 D6.C 57.03,10.29 66.93,10.29 70.74,6.48 | U7.1 72.71,15.48 | 72.71,15.48 C32.1 71.19,12.45 71.19,9.97 C3.+ 70.74,6.48 | C5.+ 77.56,15.48 72.71,15.48 | v84.96,63.63 88.77,67.44 88.77,72.4 86.12,75.06 38.99,75.06 v38.61,74.68 | v36.2,74.68 35.31,73.79 35.31,63.5 | LCD.5V 35.31,62.99 35.31,63.5 | 35.31,63.5 40.51,63.5 41.27,64.26 JP1.1 | 70.74,6.48 70.74,6.16 C4.1
  Bottom 0.152: v22.73,27.69 v22.73,29.16 | v23.4,36.48 23.4,37.95 v24,38.55 | v37.34,54.99 v39.12,54.99
  Bottom 0.508: v85.98,62.61 v84.96,63.63 | v38.61,74.68 v36.2,74.68
-5V  (via drill 0.35)
  Top 0.152: U5.5 31.11,22.86 C20.+ 33.27,25.02 33.27,27.05 32.31,28.01 32.31,31.33 32.26,31.38 32.26,34.16 31.11,35.31 31.11,35.32 30.87,35.56 28.45,35.56 28.19,35.81 28.19,36.45 28.57,36.83 32.06,36.83 C30.2 | U9.4 36.13,47.37 C28.2 37.78,44.64 v36.96,43.81 | v36.15,42.88 34.67,41.4 v34.67,40.39 | v34.67,38.89 33.88,38.1 C30.2 | C30.2 34.98,36.45 U8.4
  Bottom 0.152: v36.96,43.81 36.15,43 v36.15,42.88 | v34.67,40.39 v34.67,38.89
ADC_RDY  (via drill 0.35)
  Top 0.152: R20.1 43.56,44.19 43.56,42.16 | 43.56,42.16 43.17,41.77 U3.2 | 43.56,42.16 43.56,40.13 45.82,37.87 48.64,37.87 v48.89,38.13 | v52.17,38.1 54.74,38.1 59.69,33.15 63.55,33.15 U1.25
  Bottom 0.152: v52.17,38.1 52.14,38.13 v48.89,38.13
BOOT0  (via drill 0.35)
  Top 0.152: v74.8,30.35 75.59,29.57 BOOT.2 77.92,25.61 R2.2 C12.1 | U1.44 73.91,31.29 v73.91,31.24
  Bottom 0.152: v73.91,31.24 v74.8,30.35
BOOT1
  Top 0.152: U1.20 64.64,38.44 64.64,40.13 R3.1
BUZZER
  Top 0.152: U4.5 71.25,57.47 R14.2 Q1.1
DAC_OUT
  Top 0.152: U8.3 36.2,34.92 36.7,34.42 36.7,32 37.08,31.62 38.48,31.62 38.73,31.88 38.73,33.66 39.12,34.04 42.67,34.04 42.93,34.29 42.93,34.99 U2.1
ENC_A
  Top 0.152: U1.17 65.79,39.41 65.79,41.78 64.37,43.2 62.84,43.2 62.82,43.18 58.93,43.18 56.77,45.34 56.77,49.78 56.52,50.04 53.09,50.04 49.28,53.85 49.28,57.78 48.89,58.17 45.59,58.17 43.94,59.82 43.94,62.99 45.21,64.26 50.29,64.26 50.93,64.9 50.93,72.26 52.07,73.41 65.1,73.41 ENC.5
ENC_B  (via drill 0.35)
  Top 0.152: v53.15,42.85 53.96,42.04 54.23,42.04 55.5,40.77 55.5,38.48 60.29,33.69 62.52,33.69 63.25,34.42 64.64,34.42 65,34.06 v67.44,34.06 | v53.09,45.85 53.09,49.02 48.24,53.86 48.24,56.64 47.61,57.28 45.11,57.28 42.91,59.47 42.91,63.21 44.99,65.29 49.66,65.29 49.91,65.55 49.91,72.64 51.44,74.17 66.84,74.17 ENC.4 | U1.2 73.08,35.61 67.74,35.61 v67.44,35.91
  Bottom 0.152: v53.15,42.85 53.15,45.78 v53.09,45.85 | v67.44,35.91 v67.44,34.06
ENC_BTN  (via drill 0.35)
  Top 0.152: v54.1,42.93 54.23,42.93 56.01,41.15 56.01,38.61 60.2,34.42 61.85,34.42 62.48,35.05 64.52,35.05 64.9,34.67 69.41,34.67 v70.27,33.81 | v54.1,45.82 54.1,49.02 53.59,49.53 53.09,49.53 48.77,53.85 48.77,57 48.03,57.73 45.39,57.73 43.43,59.69 43.43,63.12 45.09,64.77 50.04,64.77 50.42,65.15 50.42,72.39 51.82,73.79 66.42,73.79 68.07,72.14 68.07,70.87 68.71,70.23 70.23,70.23 ENC.3 | v71.17,32.72 70.23,31.78 70.23,30.73 U1.38
  Bottom 0.152: v54.1,45.82 v54.1,42.93 | v70.27,33.81 71.17,32.91 v71.17,32.72
FAN  (via drill 0.3, 0.35)
  Top 0.152: U1.46 72.9,33.72 72.9,34.04 73.23,34.37 77.27,34.37 78.61,33.02 78.61,28.45 v78.23,28.07 | v76.33,26.16 73.91,23.75 70.99,23.75 69.85,22.61 64.52,22.61 57.91,16 57.91,12.45 57.28,11.81 48.89,11.81 v46.61,9.53 | v46.61,7.62 48.01,6.22 48.01,1.91 47.24,1.14 37.85,1.14 37.08,1.91 37.08,4.57 38.35,5.84 39.5,5.84 40.19,6.54 R15.2
  Bottom 0.152: v78.23,28.07 v76.33,26.16 | v46.61,9.53 v46.61,7.62
GND  (via drill 0.3, 0.45)
  Top 0.152: R31.1 20.39,41.91 R38.2
  Top 0.203: U1.35 66.38,28.91 C8.2 | U1.47 75.61,31.71 C9.2 | U1.8 73.33,40.09 C7.2 | U1.23 63.49,37.47 62.61,37.47 C10.2
  Top 0.305: R2.1 v80.9,24.77 | C12.2 80.52,22.48 v80.77,22.73 | v76.96,19.3 76.99,19.28 C5.- 79.31,19.28 v79.86,19.83 | v72.01,20.07 72.01,19.38 U7.2 72.06,19.43 v72.9,19.43 | v70.23,19.81 70.1,19.69 C31.2 69.03,18.73 v68.96,18.8 | C6.- 66.95,19.43 v68.33,19.43 | C6.- v66.8,20.7 | C6.- 66.78,19.3 v65.28,19.3 | v73.56,6.45 73.56,5.38 C4.2 v74.57,5.31 | C1.2 75.72,5.38 v75.72,6.45 | J2.5 62.25,4.86 v62.25,5.19 | C22.1 23.18,21.53 v23.24,21.59 | U5.3 v22.61,24.13 | C27.1 33.46,30.61 v34.42,30.61 | C27.1 33.4,30.55 v33.4,31.62 | C27.1 33.34,29.4 v33.4,29.34 | C19.2 43.14,32.66 v43.14,33.57 | C19.2 v41.78,32.38 | C19.2 42.8,32.32 v42.8,31.24 | v75.69,13.97 C32.2 74.61,12.89 v74.68,12.83 | C8.2 65.59,27.81 v65.53,27.81 | C7.2 73.82,40.71 v74.39,41.27 | C10.2 63.25,38.1 v63.25,38.23 | R3.2 62.39,41.95 v61.72,41.27 | C9.2 76.45,30.91 v76.45,30.86 | C15.2 85.25,36.48 v85.25,37.09 | C16.2 85.98,44.13 v85.98,44.83 | C14.2 83.31,45.85 v83.44,45.85 | C13.2 78.23,50.93 v78.23,51.05 | RST.1 v64.39,47.75 | C11.2 63.12,50.99 v63.12,52 | ST.C v68.83,53.34 | U4.8 71.56,53.4 v71.37,53.21 | R14.1 65.6,59.37 v64.77,60.2 | U4.3 v73.03,60.32 | C17.2 78.99,65.47 v78.99,66.67 | C17.2 77.98,65.41 v77.85,65.53 | C17.2 79.06,64.2 v78.99,64.14 | R13.1 52.39,68.9 v52.45,68.96 | R17.1 48.07,73.41 v49.28,73.41 | C23.2 43.18,54.61 v43.05,54.74 | C29.1 36.83,53.34 v36.7,53.21 | C26.2 v34.42,53.59 | C28.1 39.81,45.85 v40.77,45.85 | R23.1 46.05,46.38 v46.77,46.38 | R34.1 31.54,44.11 v31.5,44.07 | C30.1 v30.35,38.1 | R32.2 v40.77,37.47 | U3.5 42.42,40.16 v42.42,39.62 | U3.3 41.15,41.27 v40.89,41.53 | U3.1 42.04,42.54 v42.04,42.93 | C18.2 47.98,40.33 v47.92,40.26 | U2.6 42.87,38.55 v42.93,38.61
  Top 0.305: C25.1 40.68,35.14 v40.77,35.05
  Top 2.54: LOAD.2 5.28,18.61 7.62,20.95 7.62,26.04 12.07,30.48 19.68,30.48 21.59,32.38 21.59,36.83 18.41,40.01 R31.1 18.41,43.18 20.32,45.09 24.77,45.09 D4.C
  Bottom 2.54: LOAD.2 5.28,18.61 7.62,20.95 7.62,26.04 12.07,30.48 19.68,30.48 21.59,32.38 21.59,36.83 18.41,40.01 18.41,43.18 20.32,45.09 24.77,45.09 D4.C
  other vias: 48.01,38.61 38.35,42.55 37.34,41.4 35.31,43.43 36.32,44.58 33.53,40.26 35.69,39.12 23.49,39.37 23.75,35.56 55.12,45.85 23.75,29.34 23.49,26.92 46.1,10.41 46.48,6.6 50.16,7.49 50.16,9.27 43.41,17.58 43.33,19.18 40.72,20.52 40.84,17.14 75.31,26.29 79.25,27.81 81.15,29.84 85.22,31.24 83.06,33.91 79.73,34.14 74.8,29.34 70.99,34.42 70.23,36.2 67.84,33.22 63.63,35.69 71.88,33.4 66.68,36.45 23.49,50.42 24.51,51.43 36.32,54.86 33.15,57.4 33.66,59.05 29.72,57.86 26.29,62.48 26.29,64.01 34.54,72.81 35.01,74.71 39.5,74.17 36.7,72.14 49.28,68.83 58.04,68.96 61.21,69.47 62.61,69.47 84.2,62.99 87,62.99 31.62,56.39 51.18,42.93 34.54,60.2 35.31,59.44 36.07,58.67 36.83,57.91 37.59,57.15 38.35,56.39 39.43,56.39 40.51,56.39 41.59,56.39 42.67,56.39 43.75,56.39 44.83,56.39 45.91,56.39 46.99,56.39 47.29,55.31 47.29,54.23 47.29,53.15 48.06,52.39 48.16,51.31 48.16,50.23 48.16,49.15 48.16,48.07 48.16,46.99 48.16,45.91 48.82,45.14 49.9,45.14 50.98,45.14 52.26,41.85 52.26,40.77 52.36,39.69 53.06,38.71 53.06,37.13 52,37.15 51.24,36.38 50.48,35.62 49.71,34.86 48.95,34.1 47.87,34.1 46.79,34.1 46.11,32.96 46.11,31.88 46.11,30.8 45.03,30.8 44.97,29.78 43.82,29.78 41.79,29.72 41.79,28.64 40.71,28.64 39.63,28.64 38.55,28.64 37.47,28.64 36.39,28.64 35.31,28.64 34.23,27.56 34.23,26.48 34.23,25.4 32.19,21.59 31.18,21.08 30.09,21.08 29.02,21.08 27.93,21.08 26.86,21.08 26.86,20 26.86,18.67 25.77,18.67 24.7,18.67 23.61,18.67 22.54,18.67 21.45,18.67 20.38,18.67 19.29,18.67 34.22,24.04 33.71,23.03 32.95,22.27 42.81,29.72 35.25,27.56 68.71,37.56 35.19,11.03 32.65,10.77 38.52,12.4
  pour Top: -0.25,74.3 1.52,76.07 3.56,76.07 88.14,76.07 89.92,74.3 89.92,1.91 87.88,-0.13 1.52,-0.13 -0.25,1.65
  pour Bottom: -0.25,74.3 1.52,76.07 3.56,76.07 88.14,76.07 89.92,74.3 89.92,1.91 87.88,-0.13 1.52,-0.13 -0.25,1.65
GND-ISO
  Top 0.305: Q2.3 15,2.75 R16.2
  Top 1.016: VFAN.2 17.79,3.95 Q2.3
ISENSE_ADC
  Top 0.152: C23.1 45.97,52.78 R25.2 46.09,52.84 46.34,52.84 47.5,51.69 47.5,44.2 46.61,43.31 46.1,43.31 45.34,42.55 45.34,40.64 45.7,40.27 U3.6
LCD_CS
  Top 0.152: RN4.5 69.98,43.72 69.98,44.07 68.58,45.47 61.72,45.47 60.32,46.86 60.32,51.69 58.67,53.34 54.99,53.34 53.34,54.99 53.34,57.28 54.23,58.17 54.23,61.09 LCD.LCD_CS
LCD_D0
  Top 0.152: RN1.6 54.13,18.16 42.29,18.16 41.78,17.65 41.78,17.26 41.06,16.54 40.54,16.54 37.21,13.21 LCD.LCD_D0
LCD_D1
  Top 0.152: LCD.LCD_D1 40.64,19.05 42.52,19.05 43.05,18.52 43.64,18.52 44.17,19.05 54.24,19.05 RN1.5
LCD_D2
  Top 0.152: RN2.8 54.34,13.08 LCD.LCD_D2
LCD_D3
  Top 0.152: RN2.7 55.22,14.73 52.45,14.73 51.44,13.72 LCD.LCD_D3
LCD_D4
  Top 0.152: LCD.LCD_D4 51.18,15.37 55.14,15.37 RN2.6
LCD_D5
  Top 0.152: LCD.LCD_D5 49.4,16.13 55.13,16.13 RN2.5
LCD_D6
  Top 0.152: RN1.8 54.22,16.76 47.5,16.76 LCD.LCD_D6
LCD_D7
  Top 0.152: LCD.LCD_D7 45.59,17.4 54.07,17.4 RN1.7
LCD_RD
  Top 0.152: RN4.8 67.77,44.32 60.07,44.32 58.55,45.85 58.55,50.67 57.53,51.69 53.98,51.69 50.93,54.74 50.93,58.8 49.91,59.82 47.88,59.82 LCD.LCD_RD
LCD_RS
  Top 0.152: RN4.6 69.47,44.07 68.45,45.09 61.09,45.09 59.69,46.48 59.69,51.43 58.29,52.83 54.61,52.83 52.58,54.86 52.58,60.2 LCD.LCD_RS
LCD_RST
  Top 0.152: U1.10 71.76,39.94 71.76,40.56 70.61,41.71 70.61,44.07 68.71,45.97 62.23,45.97 60.96,47.24 60.96,51.94 58.93,53.98 55.5,53.98 53.98,55.5 53.98,57.02 54.99,58.04 56.26,58.04 56.52,58.29 LCD.LCD_RST
LCD_WR
  Top 0.152: RN4.7 68.97,44.06 68.33,44.7 60.58,44.7 59.05,46.23 59.05,51.05 57.91,52.2 54.36,52.2 51.69,54.86 51.69,59.05 50.42,60.32 49.66,60.32 48.89,61.09 LCD.LCD_WR
LOAD+  (via drill 0.3)
  Top 0.152: RL1.NC1 27.3,64.68 v27.3,64.01 | v27.3,62.61 27.3,60.96 28.45,59.82 28.45,53.98 v25.53,51.05 | v24.26,49.78 23.11,48.64 20.07,48.64 15.75,44.32 15.75,38.86 17.02,37.59 18.03,37.59 18.41,37.21 F1.1
  Top 2.54: FET.2 12.7,42.64 12.7,37.47 14.61,35.56 F1.1
  Bottom 0.152: v27.3,64.01 v27.3,62.61 | v25.53,51.05 v24.26,49.78
  Bottom 2.54: F1.1 14.61,35.56 12.7,37.47 12.7,42.55 2.63,52.61 FET.2
N$1
  Top 0.152: Q1.3 59.89,56.5 LS1.N
N$2  (via drill 0.35)
  Top 0.152: RN1.3 62.17,26.2 66.71,26.2 67.17,25.74 67.96,25.74 69.39,27.18 69.36,27.21 v69.36,33.79 | v69.36,36.45 69.36,36.52 68.96,36.93 67.57,36.93 U1.18
  Bottom 0.152: v69.36,36.45 v69.36,33.79
N$3  (via drill 0.35)
  Top 0.152: RN1.4 61.73,26.54 66.8,26.54 67.3,26.05 67.83,26.05 68.96,27.18 68.96,32.77 68.45,33.27 v68.45,33.91 | v68.45,36.32 67.89,36.32 67.69,36.52 67.43,36.52 66.92,37.03 66.76,37.03 U1.19
  Bottom 0.152: v68.45,36.32 v68.45,33.91
N$4
  Top 0.152: PWR.A R11.2
N$5
  Top 0.152: U1.39 71.63,30.04 71.63,28.96 68.11,25.44 67.04,25.44 66.7,25.78 62.46,25.78 RN1.2
N$6
  Top 0.406: J2.1 59.02,4.86 58.16,5.72 D6.A
N$7
  Top 0.152: U1.40 72.01,30.36 72.01,28.58 68.45,25.02 62.56,25.02 RN1.1
N$8
  Top 0.152: U1.41 72.39,30.69 72.39,28.19 68.83,24.64 63.64,24.64 RN2.4
N$9
  Top 0.152: RN2.3 63.91,24.13 69.09,24.13 72.9,27.94 72.9,30.89 U1.42
N$10
  Top 0.152: RN2.1 64.46,23.11 69.6,23.11 74.04,27.56 74.04,30.48 74.55,30.99 74.55,31.47 74.17,31.85 74.06,31.85 U1.45
N$11
  Top 0.152: RN2.2 64.19,23.7 64.55,23.7 64.63,23.62 69.34,23.62 73.41,27.69 73.41,30.23 73.28,30.35 73.28,31.22 U1.43
N$12
  Top 0.152: RN3.3 60.99,32.51 63.62,32.51 U1.26
N$13
  Top 0.152: RN3.2 61.19,32 63.82,32 U1.27
N$14
  Top 0.152: U1.28 64.7,32.18 64.64,32.18 63.96,31.5 61.46,31.5 RN3.1
N$15
  Top 0.152: U1.11 71.25,40.14 71.25,40.64 70.74,41.15 70.23,41.15 70.02,41.36 RN4.4
N$16
  Top 0.152: J2.3 60.32,5.08 60.96,5.71 61.85,5.71 61.98,5.84 R9.1
N$17
  Top 0.152: U1.12 69.47,41.04 RN4.3
N$18
  Top 0.152: R8.1 59.69,4.25 J2.2
N$19
  Top 0.152: U1.14 67.18,40.14 67.18,40.64 67.69,41.15 68.2,41.15 68.42,41.36 RN4.1
N$20
  Top 0.152: U1.13 68.97,41.04 RN4.2
N$21
  Top 0.152: OC1.3 19.56,10.41 17.14,12.83 17.14,13.21 15.75,14.61 9.91,14.61 8.89,13.59 8.89,8 10.4,6.49 Q2.1 11.75,2.6 R16.1
N$22
  Top 0.152: R1.2 65.73,53.44 ST.A
N$23
  Top 0.152: R15.1 38.29,8.95 37.64,9.6 30.18,9.6 OC1.1
N$24
  Top 0.406: 25.42,4.57 25.55,4.7 30.48,4.7 32.01,6.23 D1.A
  Top 1.016: FAN.2 25.42,4.57 19.05,4.57 17.14,6.48 14.99,6.48 12.7,8.76 Q2.2
N$25
  Top 0.152: Q3.3 43.02,73.14 D2.A 41.21,73.2 RL1.-
N$26
  Top 0.152: OC1.4 19.18,9.53 19.14,9.53 18.82,9.84 R19.2
N$27
  Top 0.152: D2.C 42.93,67.44 42.93,66.29 42.67,66.04 JP1.2 38.82,66.04 RL1.+
N$29
  Top 0.152: C21.+ 17.53,25.4 U5.2
N$30
  Top 0.152: C21.- 17.53,22.86 U5.4
N$31
  Top 2.54: LOAD.1 2.54,27.2 2.54,34.92 F1.2
  Bottom 2.54: LOAD.1 2.63,35.02 F1.2
N$32
  Top 0.152: C22.2 25.08,24.19 26.29,25.4 U5.7
N$33
  Top 0.152: R34.2 R33.1 34.29,47.78 34.29,47.93 35.25,48.89 35.41,48.89 35.56,48.89 U9.3
N$34  (via drill 0.35)
  Top 0.152: R22.2 45.97,48.01 | 45.97,48.01 45.67,48.01 44.87,48.81 43.61,48.81 43.05,48.26 40.25,48.26 38.86,49.64 38.86,52.44 38.81,52.49 38.81,54.41 34.8,58.42 30.99,58.42 29.84,59.56 29.84,62.36 28.96,63.25 21.72,63.25 20.19,64.77 R31.2 | 45.97,48.01 45.03,47.07 45.03,45.79 44.83,45.59 44.7,45.59 44.69,45.61 42.81,45.61 40.51,43.31 37.72,43.31 v37.73,43.3 | v36.79,42.23 35.81,41.26 35.81,40.26 35.05,39.5 27.12,39.5 R27.1
  Top 2.54: 19.44,61.2 22.22,58.42 D4.A | 19.44,61.2 18.41,62.23 R31.2 | FET.1 19.44,61.2
  Bottom 0.152: v37.73,43.3 36.79,42.36 v36.79,42.23
  Bottom 2.54: FET.1 18.02,61.2 | 18.02,61.2 18.41,61.59 R31.2 | 18.02,61.2 19.44,61.2 22.22,58.42 D4.A
N$35
  Top 0.152: U9.5 43.91,47.62 R22.1 R23.2
N$36
  Top 0.152: U9.6 43.09,48.89 43.79,49.59 R21.1 45.88,51.17 R24.1
N$37
  Top 0.152: C24.1 25.09,34.71 R26.1
N$38
  Top 0.152: U9.7 43.29,50.16 R24.2 R25.1
N$39
  Top 0.152: C24.2 25.09,31.75 | 25.09,31.75 R28.2 | 25.09,31.75 27.69,31.75 28.19,32.26 28.19,33.27 28.57,33.66 U8.7
N$40
  Top 0.152: C25.2 R32.1 | R30.1 C25.2 | C25.2 37.36,35.56 31.5,35.56 30.86,36.2 U8.5
N$41
  Top 0.152: U8.6 27.2,34.92 R26.2 R27.2
N$42
  Top 0.152: R28.1 25.08,28.58 14.35,28.58 10.54,24.77 10.54,19.05 8.25,16.76 1.4,16.76 0.28,17.88 0.28,21.72 2.69,24.13 3.56,24.13 5.46,26.04 5.46,41.38 FET.3
N$43
  Top 0.152: R30.2 R29.1
N$44
  Top 0.152: R29.2 36.89,30.48 U8.1 U8.2
N$45
  Top 0.152: R36.2 33.18,48.37 R35.1 35.03,50.16 U9.2
N$46  (via drill 0.3)
  Top 0.152: R38.1 24,41.53 25.4,40.13 28.07,40.13 29.08,41.15 29.08,58.17 29.62,58.71 v29.88,58.71 | R21.2 46.24,49.59 46.81,50.16 46.81,51.73 46.57,51.97 45.4,51.97 45.27,52.11 45.27,53.16 44.83,53.59 41.27,53.59 39.7,55.17 39.7,55.23 39.36,55.57 38.88,55.57 38.8,55.5 38.15,55.5 33.96,59.69 v32.97,59.69
  Bottom 0.152: v29.88,58.71 30.86,59.69 v32.97,59.69
N$47
  Top 0.152: R37.1 31.59,51.67 R36.1 34.65,51.43 U9.1
NRST
  Top 0.152: U1.7 72.93,38.99 73.55,38.99 73.66,38.88 73.85,38.88 75.04,40.07 75.04,41.54 72.63,43.95 72.63,44.18 RST.2 67.09,49.73 67.09,50.71 R4.1 C11.1
OSC32_IN
  Top 0.152: U1.4 74.02,37.96 74.23,37.96 76.02,39.75 81.76,39.75 82.92,40.91 | Y2.4 81.65,40.91 82.92,40.91 | C16.1 84.65,41.72 83.84,40.91 82.92,40.91
OSC32_OUT
  Top 0.152: U1.3 74.54,37.77 Y2.1 83.64,37.77 84.65,36.76 C15.1
OSC_IN
  Top 0.152: U1.5 73.62,38.27 74.1,38.27 77.36,41.53 Y1.2 79.61,42.15 81.09,43.62 | C14.1 81.09,43.62 | R12.2 81.09,44 81.09,43.62
OSC_OUT
  Top 0.152: U1.6 73.22,38.57 73.97,38.57 75.35,39.95 75.35,41.67 73.77,43.25 Y1.1 75.06,47.03 78,47.03 | R12.1 78,47.03 | 78,47.03 C13.1
RX
  Top 0.152: U1.31 65.76,31.12 65.41,31.12 62.74,28.45 61.09,28.45 53.72,21.08 40.98,21.08 40.96,21.11 40.48,21.11 40.13,20.76 40.13,20.02 34.29,14.17 34.26,14.17 33.6,13.52 33.6,11.61 34.92,10.29 41.4,10.29 42.55,9.14 42.55,6.35 40.6,4.41 SERIAL.1
SCL  (via drill 0.35)
  Top 0.152: U3.10 46.85,42.27 49.02,44.45 v52.2,44.45 55.45,44.45 R6.1 62.41,40.42 64.21,38.62 64.21,38.16 U1.21 66.09,36.28 66.09,36.21 67,35.31 79.49,35.31 80.39,34.41 80.39,33.41 80.65,33.15 87,33.15 88.08,34.24 88.08,42.02 88.01,42.09 88.01,51.77 EXP.3 85.65,53.42 83.31,55.75 83.31,58.67 81.66,60.32 U4.14 | v52.2,42.93 51.05,41.78 51.05,38.61 48.64,36.2 44.2,36.2 43.81,36.58 U2.5
  Bottom 0.152: v52.2,44.45 v52.2,42.93
SD_MISO
  Top 0.152: RN3.7 53.31,24.13 38.1,24.13 LCD.SD_DO
SD_MOSI
  Top 0.152: LCD.SD_DI 37.08,20.57 37.21,20.7 39.37,22.86 52.82,22.86 RN3.8
SD_SCK
  Top 0.152: LCD.SD_SCK 25.27,13.08 37.34,25.15 53.62,25.15 RN3.6
SD_SS
  Top 0.152: U1.29 64.98,31.75 64.77,31.75 62.36,29.34 60.32,29.34 53.09,22.1 40.61,22.1 32.13,13.62 LCD.SD_SS
SDA  (via drill 0.35)
  Top 0.152: U3.9 47.62,41.77 48.17,42.33 48.17,42.97 48.3,43.1 48.31,43.1 48.89,43.69 50.42,43.69 | 50.42,43.69 50.55,43.69 | 50.55,43.69 50.67,43.69 | 50.67,43.69 54.74,43.69 58.09,40.33 58.12,40.33 59.55,38.9 R5.1 63.5,38.9 63.9,38.5 63.9,37.76 U1.22 66.66,35 77.93,35 v79.78,33.15 | U2.4 49.02,37.34 50.55,38.86 50.55,43.56 | 50.55,43.56 50.55,43.69 | 50.67,43.69 50.55,43.56 | 50.42,43.69 50.55,43.56 | U4.15 82.04,61.59 83.95,59.69 83.95,56.39 84.42,55.92 EXP.2 88.39,53.89 88.39,34.11 86.82,32.54 v83.44,32.54
  Bottom 0.152: v83.44,32.54 83.41,32.52 80.42,32.52 v79.78,33.15
SENSE_RELAY  (via drill 0.35)
  Top 0.152: U4.4 69.72,59.05 61.85,66.93 61.85,71.63 60.57,72.91 59.69,72.91 59.56,72.91 53.13,72.91 v53.02,72.8 | Q3.1 R17.2 48.31,71.44 v49.3,72.44
  Bottom 0.152: v53.02,72.8 49.67,72.8 v49.3,72.44
ST_LED
  Top 0.152: R1.1 68.9,56.52 U4.6
SWDCLK  (via drill 0.3)
  Top 0.152: U1.37 69.85,30.4 69.85,32.26 72.26,34.67 77.6,34.67 79.12,33.15 79.12,29.46 79.5,29.08 83.31,29.08 83.82,28.58 83.82,22.86 80.01,19.05 80.01,18.29 79.38,17.65 76.84,17.65 76.45,17.27 76.45,16.38 76.33,16.26 73.28,16.26 72.64,16.89 71.3,16.89 71.08,16.68 71.08,16.09 70.11,15.11 68.83,15.11 67.18,13.46 67.18,13.21 64.9,10.92 52.96,10.92 v51.31,9.27 | v51.31,7.62 51.31,6.1 49.28,4.06 SWD.2
  Bottom 0.152: v51.31,9.27 v51.31,7.62
SWDIO  (via drill 0.3)
  Top 0.152: U1.34 66.61,29.84 66.17,29.84 63.37,27.05 61.47,27.05 54.23,19.81 42.68,19.81 v42.55,19.67 | v42.53,17.58 39.62,14.67 39.62,12.7 40.39,11.94 43.31,11.94 v45.72,9.53 | v45.72,7.62 45.72,3.72 SWD.3
  Bottom 0.152: v42.55,19.67 42.55,17.59 v42.53,17.58 | v45.72,9.53 v45.72,7.62
TSENS0
  Top 0.152: SENS.2 57.19,68.31 R7.2 54.36,65.34 54.36,63.75 53.85,63.25 45.59,63.25 44.96,62.61 44.96,60.2 45.97,59.18 49.53,59.18 50.29,58.42 50.29,54.48 53.59,51.18 57.15,51.18 57.91,50.42 57.91,45.59 59.56,43.94 65.15,43.94 66.55,42.55 66.55,40.07 U1.15
TSENS1
  Top 0.152: SENS.3 54.29,71.36 R13.2 54.29,67.18 53.41,66.3 53.41,64.33 52.83,63.75 45.34,63.75 44.32,62.74 44.32,60.07 45.72,58.67 49.28,58.67 49.78,58.17 49.78,54.1 53.34,50.55 56.9,50.55 57.28,50.16 57.28,45.47 59.18,43.56 64.77,43.56 66.17,42.16 66.17,39.74 U1.16
TX
  Top 0.152: U1.30 65.43,31.5 65.15,31.5 62.61,28.96 60.83,28.96 53.47,21.59 40.53,21.59 33.2,14.26 33.2,11.12 34.42,9.91 41.15,9.91 41.78,9.27 41.78,6.48 40.39,5.08 38.86,5.08 38.1,4.32 SERIAL.2
USB_DN  (via drill 0.3)
  Top 0.152: U1.32 66.01,30.66 65.79,30.66 62.99,27.86 61.2,27.86 53.91,20.57 41.71,20.57 v40.77,19.63 | v40.8,18.38 37.91,15.49 37.59,15.49 35.81,13.72 35.81,12.52 37.48,10.85 42.49,10.85 45.14,8.2 59.32,8.2 R8.2
  Bottom 0.152: v40.77,19.63 40.77,18.41 v40.8,18.38
USB_DP  (via drill 0.3)
  Top 0.152: R10.1 R9.2 61.83,8.57 60.95,9.45 58.66,9.45 57.72,8.51 45.26,8.51 42.61,11.16 37.61,11.16 36.12,12.65 36.12,13.59 37.72,15.19 38.06,15.19 40.68,17.8 41.04,17.8 v41.65,18.41 v41.66,18.41 | U1.33 66.41,30.35 65.91,30.35 63.12,27.56 61.34,27.56 54.04,20.26 41.85,20.26 41.63,20.04 v41.63,19.67
  Bottom 0.152: v41.63,19.67 41.63,18.45 v41.66,18.41
VBAT
  Top 0.152: D3.3 78.44,36.96 75.14,36.96 U1.1
VBAT_UNPROTECTED
  Top 0.152: D3.2 86.17,31.92 BAT.1
VCC-ISO  (via drill 0.3)
  Top 0.152: R19.1 19.88,5.84 v21.46,5.84
  Top 0.406: FAN.1 30.62,2.67 D1.C
  Top 1.016: VFAN.1 24.51,2.67 25.93,1.25 28.94,1.25 29.84,2.16 29.84,2.65 FAN.1
  Bottom 0.152: v21.46,5.84 21.46,2.77 VFAN.1
VSENS+  (via drill 0.3)
  Top 0.152: R33.2 29.92,48.34 29.92,56.4 v30.96,57.43 | v31.21,59.02 31.95,59.77 31.95,60.45 32.28,60.78 32.28,61.91 33.29,62.92 RL1.COM1
  Bottom 0.152: v30.96,57.43 30.96,58.77 v31.21,59.02
VSENS+_EXT
  Top 0.152: EXT_SENSE.1 23.34,65.59 RL1.NO1
VSENS-  (via drill 0.3)
  Top 0.152: R35.2 31,48.37 30.23,49.15 30.23,55.88 31.37,57.02 31.88,57.02 v32.26,57.4 | v32.26,59 32.26,60.32 32.59,60.66 32.59,61.78 33.21,62.41 33.58,62.41 34.54,63.37 34.54,71.95 RL1.COM2
  Bottom 0.152: v32.26,57.4 v32.26,59
VSENS-_EXT
  Top 0.152: EXT_SENSE.2 19.84,73.2 RL1.NO2
VSENSE_ADC
  Top 0.152: C26.1 31.43,53.47 R37.2 33.53,51.96 37.33,51.96 37.85,51.45 37.85,48.64 37.36,48.15 34.94,48.15 34.67,47.88 34.67,45.21 39.11,40.77 U3.4

### Text on the board
tPlace: A | B | BTN | 3V3 | GND | +5V | T1 | T0 | SDA | GND | 3V3 | SCL | GND | S | D | G | C:/Users/1/Documents/EAGLE/projects/Carrega/logoo.bmp | VFAN | FAN | V- | V+ | L- | L+ | TX | RX | SWIO | SWCK | GND | GND